# EAGLE design harp load cells v1.1 (EAGLE 6.5.0)
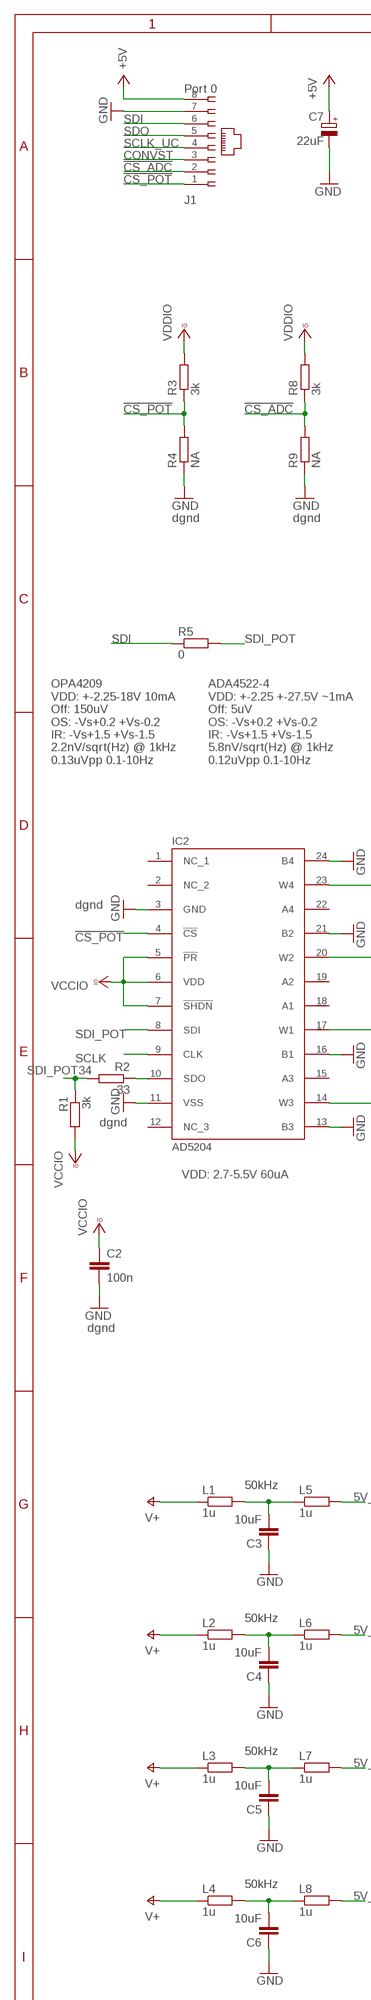
[diagram p0: schematic, sheet 1, part 1 of 2]
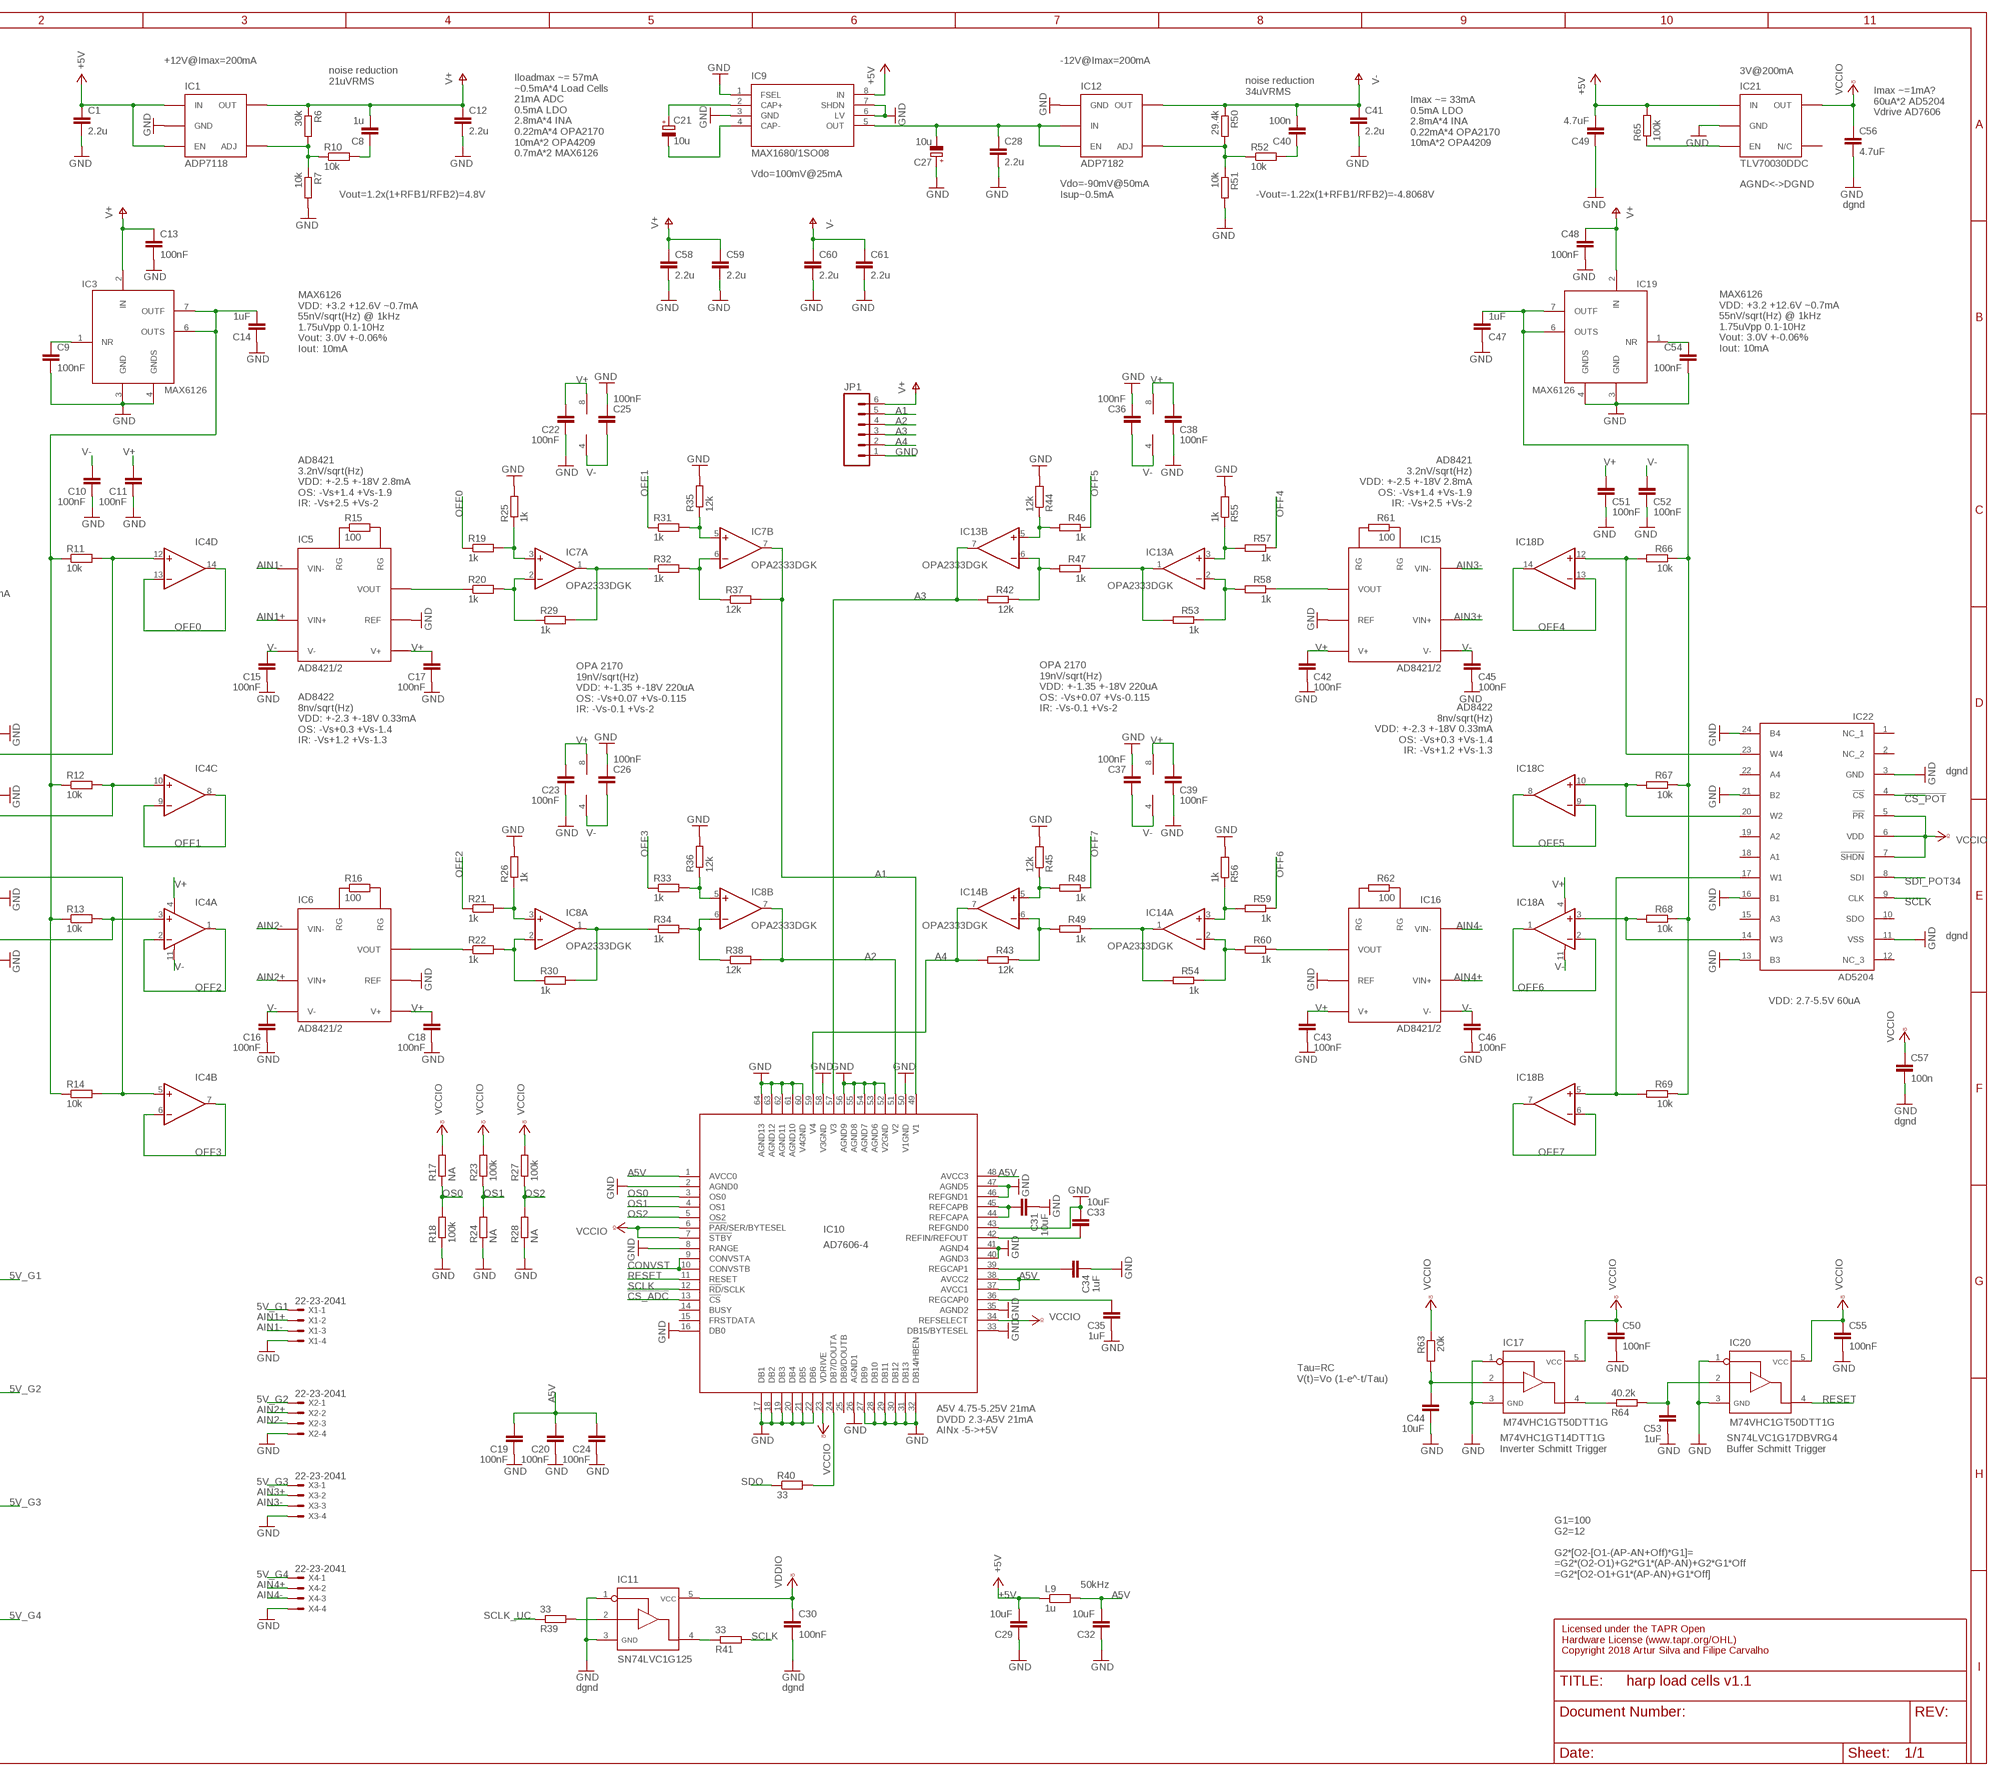
[diagram p1: schematic, sheet 1, part 2 of 2]

## Parts
C1  2.2u  C-EUC0603  [C0603]
C2  100n  C-EUC0402  [C0402]
C3  10uF  C-EUC0603  [C0603]
C4  10uF  C-EUC0603  [C0603]
C5  10uF  C-EUC0603  [C0603]
C6  10uF  C-EUC0603  [C0603]
C7  22uF  CAP_100UFHAND  [CAP_100UF_HAND]
C8  1u  C-EUC0402  [C0402]
C9  100nF  C-EUC0402  [C0402]
C10  100nF  C-EUC0402  [C0402]
C11  100nF  C-EUC0402  [C0402]
C12  2.2u  C-EUC0603  [C0603]
C13  100nF  C-EUC0402  [C0402]
C14  1uF  C-EUC0603  [C0603]
C15  100nF  C-EUC0402  [C0402]
C16  100nF  C-EUC0402  [C0402]
C17  100nF  C-EUC0402  [C0402]
C18  100nF  C-EUC0402  [C0402]
C19  100nF  C-EUC0402  [C0402]
C20  100nF  C-EUC0402  [C0402]
C21  10u  CPOL-EUA/3216-18W  [A/3216-18W]
C22  100nF  C-EUC0402  [C0402]
C23  100nF  C-EUC0402  [C0402]
C24  100nF  C-EUC0402  [C0402]
C25  100nF  C-EUC0402  [C0402]
C26  100nF  C-EUC0402  [C0402]
C27  10u  CPOL-EUA/3216-18W  [A/3216-18W]
C28  2.2u  C-EUC0603  [C0603]
C29  10uF  C-EUC0603  [C0603]
C30  100nF  C-EUC0402  [C0402]
C31  10uF  C-EUC0603  [C0603]
C32  10uF  C-EUC0603  [C0603]
C33  10uF  C-EUC0603  [C0603]
C34  1uF  C-EUC0402  [C0402]
C35  1uF  C-EUC0402  [C0402]
C36  100nF  C-EUC0402  [C0402]
C37  100nF  C-EUC0402  [C0402]
C38  100nF  C-EUC0402  [C0402]
C39  100nF  C-EUC0402  [C0402]
C40  100n  C-EUC0402  [C0402]
C41  2.2u  C-EUC0603  [C0603]
C42  100nF  C-EUC0402  [C0402]
C43  100nF  C-EUC0402  [C0402]
C44  10uF  C-EUC0603  [C0603]
C45  100nF  C-EUC0402  [C0402]
C46  100nF  C-EUC0402  [C0402]
C47  1uF  C-EUC0603  [C0603]
C48  100nF  C-EUC0402  [C0402]
C49  4.7uF  C-EUC0603  [C0603]
C50  100nF  C-EUC0402  [C0402]
C51  100nF  C-EUC0402  [C0402]
C52  100nF  C-EUC0402  [C0402]
C53  1uF  C-EUC0603  [C0603]
C54  100nF  C-EUC0402  [C0402]
C55  100nF  C-EUC0402  [C0402]
C56  4.7uF  C-EUC0603  [C0603]
C57  100n  C-EUC0402  [C0402]
C58  2.2u  C-EUC0603  [C0603]
C59  2.2u  C-EUC0603  [C0603]
C60  2.2u  C-EUC0603  [C0603]
C61  2.2u  C-EUC0603  [C0603]
IC1  ADP7118  [TSOT23-5]
IC2  AD5204  [TSSOP-24]
IC3  MAX6126  [SO08]
IC4  OPA4336T  [TSSOP-14]
IC5  AD8421/2  [MSOP8]
IC6  AD8421/2  [MSOP8]
IC7  OPA2333DGK  [MSOP08]
IC8  OPA2333DGK  [MSOP08]
IC9  MAX1680/1SO08  [SO08]
IC10  AD7606-4  [LQFP-64]
IC11  SN74LVC1G125  [SOT23-5]
IC12  ADP7182  [TSOT23-5]
IC13  OPA2333DGK  [MSOP08]
IC14  OPA2333DGK  [MSOP08]
IC15  AD8421/2  [MSOP8]
IC16  AD8421/2  [MSOP8]
IC17  M74VHC1GT50DTT1G  SN74LVC1G125  [SOT23-5]
IC18  OPA4336T  [TSSOP-14]
IC19  MAX6126  [SO08]
IC20  M74VHC1GT50DTT1G  SN74LVC1G125  [SOT23-5]
IC21  TLV70030DDC  TLV700XX  [TSOT23-5]
IC22  AD5204  [TSSOP-24]
J1  Port 0  520426-4  [520426-4]
JP1  M06NO_SILK  [1X06_NO_SILK]
L1  1u  R-EU_R0402  [R0402]
L2  1u  R-EU_R0402  [R0402]
L3  1u  R-EU_R0402  [R0402]
L4  1u  R-EU_R0402  [R0402]
L5  1u  R-EU_R0402  [R0402]
L6  1u  R-EU_R0402  [R0402]
L7  1u  R-EU_R0402  [R0402]
L8  1u  R-EU_R0402  [R0402]
L9  1u  R-EU_R0402  [R0402]
R1  3k  R-EU_R0402  [R0402]
R2  33  R-EU_R0402  [R0402]
R3  3k  R-EU_R0402  [R0402]
R4  NA  R-EU_R0402  [R0402]
R5  0  R-EU_R0402  [R0402]
R6  30k  R-EU_R0402  [R0402]
R7  10k  R-EU_R0402  [R0402]
R8  3k  R-EU_R0402  [R0402]
R9  NA  R-EU_R0402  [R0402]
R10  10k  R-EU_R0402  [R0402]
R11  10k  R-EU_R0402  [R0402]
R12  10k  R-EU_R0402  [R0402]
R13  10k  R-EU_R0402  [R0402]
R14  10k  R-EU_R0402  [R0402]
R15  100  R-EU_R0402  [R0402]
R16  100  R-EU_R0402  [R0402]
R17  NA  R-EU_R0402  [R0402]
R18  100k  R-EU_R0402  [R0402]
R19  1k  R-EU_R0402  [R0402]
R20  1k  R-EU_R0402  [R0402]
R21  1k  R-EU_R0402  [R0402]
R22  1k  R-EU_R0402  [R0402]
R23  100k  R-EU_R0402  [R0402]
R24  NA  R-EU_R0402  [R0402]
R25  1k  R-EU_R0402  [R0402]
R26  1k  R-EU_R0402  [R0402]
R27  100k  R-EU_R0402  [R0402]
R28  NA  R-EU_R0402  [R0402]
R29  1k  R-EU_R0402  [R0402]
R30  1k  R-EU_R0402  [R0402]
R31  1k  R-EU_R0402  [R0402]
R32  1k  R-EU_R0402  [R0402]
R33  1k  R-EU_R0402  [R0402]
R34  1k  R-EU_R0402  [R0402]
R35  12k  R-EU_R0402  [R0402]
R36  12k  R-EU_R0402  [R0402]
R37  12k  R-EU_R0402  [R0402]
R38  12k  R-EU_R0402  [R0402]
R39  33  R-EU_R0402  [R0402]
R40  33  R-EU_R0402  [R0402]
R41  33  R-EU_R0402  [R0402]
R42  12k  R-EU_R0402  [R0402]
R43  12k  R-EU_R0402  [R0402]
R44  12k  R-EU_R0402  [R0402]
R45  12k  R-EU_R0402  [R0402]
R46  1k  R-EU_R0402  [R0402]
R47  1k  R-EU_R0402  [R0402]
R48  1k  R-EU_R0402  [R0402]
R49  1k  R-EU_R0402  [R0402]
R50  29.4k  R-EU_R0402  [R0402]
R51  10k  R-EU_R0402  [R0402]
R52  10k  R-EU_R0402  [R0402]
R53  1k  R-EU_R0402  [R0402]
R54  1k  R-EU_R0402  [R0402]
R55  1k  R-EU_R0402  [R0402]
R56  1k  R-EU_R0402  [R0402]
R57  1k  R-EU_R0402  [R0402]
R58  1k  R-EU_R0402  [R0402]
R59  1k  R-EU_R0402  [R0402]
R60  1k  R-EU_R0402  [R0402]
R61  100  R-EU_R0402  [R0402]
R62  100  R-EU_R0402  [R0402]
R63  20k  R-EU_R0402  [R0402]
R64  40.2k  R-EU_R0402  [R0402]
R65  100k  R-EU_R0402  [R0402]
R66  10k  R-EU_R0402  [R0402]
R67  10k  R-EU_R0402  [R0402]
R68  10k  R-EU_R0402  [R0402]
R69  10k  R-EU_R0402  [R0402]
X1  22-23-2041  [22-23-2041]
X2  22-23-2041  [22-23-2041]
X3  22-23-2041  [22-23-2041]
X4  22-23-2041  [22-23-2041]

## Nets
5V_G1: L5.2 X1.1
5V_G2: L6.2 X2.1
5V_G3: L7.2 X3.1
5V_G4: L8.2 X4.1
!CS_ADC: IC10.13(!CS) J1.2 R8.1 R9.2
!CS_POT: IC2.4(!CS) IC22.4(!CS) J1.1 R3.1 R4.2
+5V: C1.1 C7.+ C29.2 C49.2 IC1.1(IN) IC1.3(EN) IC9.8(IN) IC21.1(IN) J1.8 L9.1 R65.2
A1: IC7.7(B:OUT) IC10.49(V1) JP1.5 R37.2
A2: IC8.7(B:OUT) IC10.51(V2) JP1.4 R38.2
A3: IC10.57(V3) IC13.7(B:OUT) JP1.3 R42.2
A4: IC10.59(V4) IC14.7(B:OUT) JP1.2 R43.2
A5V: C19.2 C20.2 C24.2 C32.2 IC10.1(AVCC0) IC10.37(AVCC1) IC10.38(AVCC2) IC10.48(AVCC3) L9.2
AIN1+: IC5.P$4(VIN+) X1.2
AIN1-: IC5.P$1(VIN-) X1.3
AIN2+: IC6.P$4(VIN+) X2.2
AIN2-: IC6.P$1(VIN-) X2.3
AIN3+: IC15.P$4(VIN+) X3.2
AIN3-: IC15.P$1(VIN-) X3.3
AIN4+: IC16.P$4(VIN+) X4.2
AIN4-: IC16.P$1(VIN-) X4.3
CONVST: IC10.9(CONVSTA) IC10.10(CONVSTB) J1.3
GND: C1.2 C2.2 C3.1 C4.1 C5.1 C6.1 C7.- C9.2 C10.1 C11.1 C12.2 C13.2 C14.1 C15.1 C16.1 C17.1 C18.1 C19.1 C20.1 C22.1 C23.1 C24.1 C25.1 C26.1 C27.+ C28.2 C29.1 C30.2 C31.1 C32.1 C33.1 C34.1 C35.1 C36.1 C37.1 C38.1 C39.1 C41.2 C42.1 C43.1 C44.1 C45.1 C46.1 C47.1 C48.2 C49.1 C50.2 C51.1 C52.1 C53.1 C54.2 C55.2 C56.2 C57.2 C58.2 C59.2 C60.2 C61.2 IC1.2(GND) IC2.3(GND) IC2.11(VSS) IC2.13(B3) IC2.16(B1) IC2.21(B2) IC2.24(B4) IC3.3(GND) IC3.4(GNDS) IC5.P$6(REF) IC6.P$6(REF) IC9.1(FSEL) IC9.3(GND) IC9.6(LV) IC9.7(SHDN) IC10.2(AGND0) IC10.8(RANGE) IC10.16(DB0) IC10.17(DB1) IC10.18(DB2) IC10.19(DB3) IC10.20(DB4) IC10.21(DB5) IC10.22(DB6) IC10.26(AGND1) IC10.27(DB9) IC10.28(DB10) IC10.29(DB11) IC10.30(DB12) IC10.31(DB13) IC10.32(DB14/HBEN) IC10.33(DB15/BYTESEL) IC10.35(AGND2) IC10.40(AGND3) IC10.41(AGND4) IC10.43(REFGND0) IC10.46(REFGND1) IC10.47(AGND5) IC10.50(V1GND) IC10.52(V2GND) IC10.53(AGND6) IC10.54(AGND7) IC10.55(AGND8) IC10.56(AGND9) IC10.58(V3GND) IC10.60(V4GND) IC10.61(AGND10) IC10.62(AGND11) IC10.63(AGND12) IC10.64(AGND13) IC11.1 IC11.3 IC12.1(GND) IC15.P$6(REF) IC16.P$6(REF) IC17.1 IC17.3 IC19.3(GND) IC19.4(GNDS) IC20.1 IC20.3 IC21.2(GND) IC22.3(GND) IC22.11(VSS) IC22.13(B3) IC22.16(B1) IC22.21(B2) IC22.24(B4) J1.7 JP1.1 R4.1 R7.2 R9.1 R18.1 R24.1 R25.2 R26.2 R28.1 R35.2 R36.2 R44.2 R45.2 R51.2 R55.2 R56.2 X1.4 X2.4 X3.4 X4.4
N$2: IC21.3(EN) R65.1
N$3: IC12.4(ADJ) R50.2 R51.1 R52.1
N$4: C44.2 IC17.2 R63.2
N$5: C35.2 IC10.36(REGCAP0)
N$6: IC6.P$7(VOUT) R22.1
N$7: C40.1 R52.2
N$8: C6.2 L4.2 L8.1
N$9: IC17.4 R64.1
N$10: C21.+ IC9.2(CAP+)
N$11: C21.- IC9.4(CAP-)
N$12: C27.- C28.1 IC9.5(OUT) IC12.2(IN) IC12.3(EN)
N$13: C53.2 IC20.2 R64.2
N$14: IC7.6(B:-IN) R32.2 R37.1
N$15: C34.2 IC10.39(REGCAP1)
N$16: IC13.2(A:-IN) R53.1 R58.2
N$17: IC7.2(A:-IN) R20.2 R29.1
N$18: IC7.3(A:+IN) R19.2 R25.1
N$19: IC7.5(B:+IN) R31.2 R35.1
N$20: C33.2 IC10.42(REFIN/REFOUT)
N$21: IC13.3(A:+IN) R55.1 R57.2
N$22: IC13.6(B:-IN) R42.1 R47.2
N$23: IC13.5(B:+IN) R44.1 R46.2
N$24: C31.2 IC10.44(REFCAPA) IC10.45(REFCAPB)
N$25: C8.1 R10.2
N$26: IC1.4(ADJ) R6.2 R7.1 R10.1
N$27: IC5.P$2(RG) R15.2
N$28: IC5.P$3(RG) R15.1
N$29: IC5.P$7(VOUT) R20.1
N$30: IC8.2(A:-IN) R22.2 R30.1
N$31: IC6.P$2(RG) R16.2
N$32: IC6.P$3(RG) R16.1
N$33: IC8.3(A:+IN) R21.2 R26.1
N$34: IC7.1(A:OUT) R29.2 R32.1
N$35: IC8.6(B:-IN) R34.2 R38.1
N$36: C9.1 IC3.1(NR)
N$37: IC8.5(B:+IN) R33.2 R36.1
N$38: IC15.P$2(RG) R61.2
N$39: IC8.1(A:OUT) R30.2 R34.1
N$40: IC15.P$3(RG) R61.1
N$41: IC15.P$7(VOUT) R58.1
N$42: IC2.20(W2) IC4.10(C:+IN) R12.2
N$43: IC16.P$2(RG) R62.2
N$44: IC2.17(W1) IC4.5(B:+IN) R14.2
N$45: IC16.P$3(RG) R62.1
N$46: C14.2 IC3.6(OUTS) IC3.7(OUTF) R11.1 R12.1 R13.1 R14.1
N$47: IC18.10(C:+IN) IC22.20(W2) R67.2
N$48: IC18.12(D:+IN) IC22.23(W4) R66.2
N$49: IC11.2 R39.2
N$50: IC2.10(SDO) R2.1
N$51: C5.2 L3.2 L7.1
N$52: IC18.3(A:+IN) IC22.14(W3) R68.2
N$53: IC18.5(B:+IN) IC22.17(W1) R69.2
N$54: IC13.1(A:OUT) R47.1 R53.2
N$55: C54.1 IC19.1(NR)
N$56: C47.2 IC19.6(OUTS) IC19.7(OUTF) R66.1 R67.1 R68.1 R69.1
N$57: IC2.14(W3) IC4.3(A:+IN) R13.2
N$58: IC14.2(A:-IN) R54.1 R60.2
N$59: IC14.3(A:+IN) R56.1 R59.2
N$60: IC14.6(B:-IN) R43.1 R49.2
N$61: IC14.5(B:+IN) R45.1 R48.2
N$62: IC2.23(W4) IC4.12(D:+IN) R11.2
N$63: IC11.4 R41.1
N$64: IC14.1(A:OUT) R49.1 R54.2
N$65: IC16.P$7(VOUT) R60.1
N$72: C4.2 L2.2 L6.1
N$73: C3.2 L1.2 L5.1
N$78: IC10.24(DB7/DOUTA) R40.2
OFF0: IC4.13(D:-IN) IC4.14(D:OUT) R19.1
OFF1: IC4.8(C:OUT) IC4.9(C:-IN) R31.1
OFF2: IC4.1(A:OUT) IC4.2(A:-IN) R21.1
OFF3: IC4.6(B:-IN) IC4.7(B:OUT) R33.1
OFF4: IC18.13(D:-IN) IC18.14(D:OUT) R57.1
OFF5: IC18.8(C:OUT) IC18.9(C:-IN) R46.1
OFF6: IC18.1(A:OUT) IC18.2(A:-IN) R59.1
OFF7: IC18.6(B:-IN) IC18.7(B:OUT) R48.1
OS0: IC10.3(OS0) R17.1 R18.2
OS1: IC10.4(OS1) R23.1 R24.2
OS2: IC10.5(OS2) R27.1 R28.2
RESET: IC10.11(RESET) IC20.4
SCLK: IC2.9(CLK) IC10.12(!RD!/SCLK) IC22.9(CLK) R41.2
SCLK_UC: J1.4 R39.1
SDI: J1.6 R5.1
SDI_POT: IC2.8(SDI) R5.2
SDI_POT34: IC22.8(SDI) R1.1 R2.2
SDO: J1.5 R40.1
V+: C8.2 C11.2 C12.1 C13.1 C17.2 C18.2 C22.2 C23.2 C38.2 C39.2 C42.2 C43.2 C48.1 C51.2 C58.1 C59.1 IC1.5(OUT) IC3.2(IN) IC4.4(A:V+) IC5.P$8(V+) IC6.P$8(V+) IC7.8(P:V+) IC8.8(P:V+) IC13.8(P:V+) IC14.8(P:V+) IC15.P$8(V+) IC16.P$8(V+) IC18.4(A:V+) IC19.2(IN) JP1.6 L1.1 L2.1 L3.1 L4.1 R6.1
V-: C10.2 C15.2 C16.2 C25.2 C26.2 C36.2 C37.2 C40.2 C41.1 C45.2 C46.2 C52.2 C60.1 C61.1 IC4.11(A:V-) IC5.P$5(V-) IC6.P$5(V-) IC7.4(P:V-) IC8.4(P:V-) IC12.5(OUT) IC13.4(P:V-) IC14.4(P:V-) IC15.P$5(V-) IC16.P$5(V-) IC18.11(A:V-) R50.1
VCCIO: C2.1 C30.1 C50.1 C55.1 C56.1 C57.1 IC2.5(!PR) IC2.6(VDD) IC2.7(!SHDN) IC10.6(!PAR!/SER/BYTESEL) IC10.7(!STBY) IC10.23(VDRIVE) IC10.34(REFSELECT) IC11.5 IC17.5 IC20.5 IC21.5(OUT) IC22.5(!PR) IC22.6(VDD) IC22.7(!SHDN) R1.2 R3.2 R8.2 R17.2 R23.2 R27.2 R63.1 ; supply symbol labelled VDDIO
Unconnected: IC2.1(NC_1) IC2.2(NC_2) IC2.12(NC_3) IC2.15(A3) IC2.18(A1) IC2.19(A2) IC2.22(A4) IC10.14(BUSY) IC10.15(FRSTDATA) IC10.25(DB8/DOUTB) IC21.4(N/C) IC22.1(NC_1) IC22.2(NC_2) IC22.10(SDO) IC22.12(NC_3) IC22.15(A3) IC22.18(A1) IC22.19(A2) IC22.22(A4)

## Notes on the sheet
- +12V@Imax=200mA | -12V@Imax=200mA
- 3V@200mA
- noise reduction 
  21uVRMS
- noise reduction 
  34uVRMS
- Imax ~=1mA?
  60uA*2 AD5204
  Vdrive AD7606
- Imax ~= 33mA 
  0.5mA LDO
  2.8mA*4 INA
  0.22mA*4 OPA2170
  10mA*2 OPA4209
- Iloadmax ~= 57mA
  ~0.5mA*4 Load Cells
  21mA ADC
  0.5mA LDO
  2.8mA*4 INA
  0.22mA*4 OPA2170
  10mA*2 OPA4209
  0.7mA*2 MAX6126
- Vdo=100mV@25mA
- AGND<->DGND
- Vout=1.2x(1+RFB1/RFB2)=4.8V
- Vdo=-90mV@50mA
  Isup~0.5mA
- -Vout=-1.22x(1+RFB1/RFB2)=-4.8068V
- dgnd
- MAX6126
  VDD: +3.2 +12.6V ~0.7mA
  55nV/sqrt(Hz) @ 1kHz
  1.75uVpp 0.1-10Hz
  Vout: 3.0V +-0.06%
  Iout: 10mA
- MAX6126
  VDD: +3.2 +12.6V ~0.7mA
  55nV/sqrt(Hz) @ 1kHz
  1.75uVpp 0.1-10Hz
  Vout: 3.0V +-0.06%
  Iout: 10mA
- dgnd | dgnd
- AD8421
  3.2nV/sqrt(Hz)
  VDD: +-2.5 +-18V 2.8mA
  OS: -Vs+1.4 +Vs-1.9
  IR: -Vs+2.5 +Vs-2
- AD8421
  3.2nV/sqrt(Hz)
  VDD: +-2.5 +-18V 2.8mA
  OS: -Vs+1.4 +Vs-1.9
  IR: -Vs+2.5 +Vs-2
- OPA4209
  VDD: +-2.25-18V 10mA
  Off: 150uV
  OS: -Vs+0.2 +Vs-0.2 
  IR: -Vs+1.5 +Vs-1.5
  2.2nV/sqrt(Hz) @ 1kHz
  0.13uVpp 0.1-10Hz
- ADA4522-4
  VDD: +-2.25 +-27.5V ~1mA
  Off: 5uV
  OS: -Vs+0.2 +Vs-0.2 
  IR: -Vs+1.5 +Vs-1.5
  5.8nV/sqrt(Hz) @ 1kHz
  0.12uVpp 0.1-10Hz
- OPA 2170
  19nV/sqrt(Hz)
  VDD: +-1.35 +-18V 220uA
  OS: -Vs+0.07 +Vs-0.115
  IR: -Vs-0.1 +Vs-2
- OPA 2170
  19nV/sqrt(Hz)
  VDD: +-1.35 +-18V 220uA
  OS: -Vs+0.07 +Vs-0.115
  IR: -Vs-0.1 +Vs-2
- AD8422
  8nv/sqrt(Hz)
  VDD: +-2.3 +-18V 0.33mA
  OS: -Vs+0.3 +Vs-1.4
  IR: -Vs+1.2 +Vs-1.3
- AD8422
  8nv/sqrt(Hz)
  VDD: +-2.3 +-18V 0.33mA
  OS: -Vs+0.3 +Vs-1.4
  IR: -Vs+1.2 +Vs-1.3
- dgnd | dgnd
- dgnd
- dgnd
- VDD: 2.7-5.5V 60uA | VDD: 2.7-5.5V 60uA
- dgnd
- dgnd
- 50kHz
- 50kHz
- Tau=RC
  V(t)=Vo (1-e^-t/Tau)
- A5V 4.75-5.25V 21mA
  DVDD 2.3-A5V 21mA
  AINx -5->+5V
- M74VHC1GT14DTT1G
  Inverter Schmitt Trigger
- SN74LVC1G17DBVRG4
  Buffer Schmitt Trigger
- 50kHz
- G1=100
  G2=12
  
  G2*[O2-[O1-(AP-AN+Off)*G1]=
  =G2*(O2-O1)+G2*G1*(AP-AN)+G2*G1*Off
  =G2*[O2-O1+G1*(AP-AN)+G1*Off]
- 50kHz
- 50kHz
- Licensed under the TAPR Open
  Hardware License (www.tapr.org/OHL)
  Copyright 2018 Artur Silva and Filipe Carvalho
- dgnd | dgnd

## Library data of the parts
C1-C6 C8-C20 C22-C26 C28-C61 = rcl:C-EU: CAPACITOR, European symbol
C7 = CNP-miscellaneous:CAP_100UF
C21 C27 = rcl:CPOL-EU: POLARIZED CAPACITOR, European symbol
IC1 = CNP-ics 2:ADP7118
IC2 IC22 = CNP-ics 1:AD5204
IC3 IC19 = CNP-ics 1:MAX6126
IC4 IC18 = CNP-ics 1:OPA4336: Single-Supply, MicroPower CMOS Operational Amplifiers MicroAmplifier (TM) Series
IC5 IC6 IC15 IC16 = CNP-ics 2:AD8421/2
IC7 IC8 IC13 IC14 = linear:OPA2333: DUAL 1.8V, microPOWER CMOS OPERATIONAL AMPLIFIERS Zerø-Drift Series Source: Texas Instruments (Burr-Brown) .. U11 opa333 Operational Amp.pdf
IC9 = CNP-ics 2:MAX1680/1
IC10 = CNP-ics 1:AD7606-4
IC11 IC17 IC20 = My_library 0v2:SN74LVC1G125
IC12 = CNP-ics 2:ADP7182
IC21 = CNP-ics 2:TLV700XX
J1 = con-amp:520426-4: AMP connector
JP1 = SparkFun-Connectors:M06: Header 6 Standard 6-pin 0.1" header. Use with straight break away headers (SKU : PRT-00116), right angle break away headers (PRT-00553), swiss pins (PRT-00743), machine pins (PRT-00117), and female headers (PRT-00115). Molex polarized connector foot print use with SKU : PRT-08094 with associated crimp pins and housings. NOTES ON THE VARIANTS LOCK and LOCK_LONGPADS... This footprint was designed to help hold the alignment of a through-hole component (i.e. 6-pin header) while soldering it into place. You may notice that each hole has been shifted either up or down by 0.005 of an inch from it's more standard position (which is a perfectly straight line). This slight alteration caused the pins (the squares in the middle) to touch the edges of the holes. Because they are alternating, it causes a "brace" to hold the component in place. 0.005 has proven to be the perfect amount of "off-center" position when using our standard breakaway headers. Although looks a little odd when you look at the bare footprint, once you have a header in there, the alteration is very hard to notice. Also,if you push a header all the way into place, it is covered up entirely on the bottom side. This idea of altering the position of holes to aid alignment will be further integrated into the Sparkfun Library for other footprints. It can help hold any component with 3 or more connection pins.
L1-L9 R1-R69 = rcl:R-EU_: RESISTOR, European symbol
X1-X4 = con-molex:22-23-2041: .100" (2.54mm) Center Header - 4 Pin; MF: MOLEX; MPN: 22-23-2041; OC_FARNELL: 1462920; OC_NEWARK: 38C0355

## Board
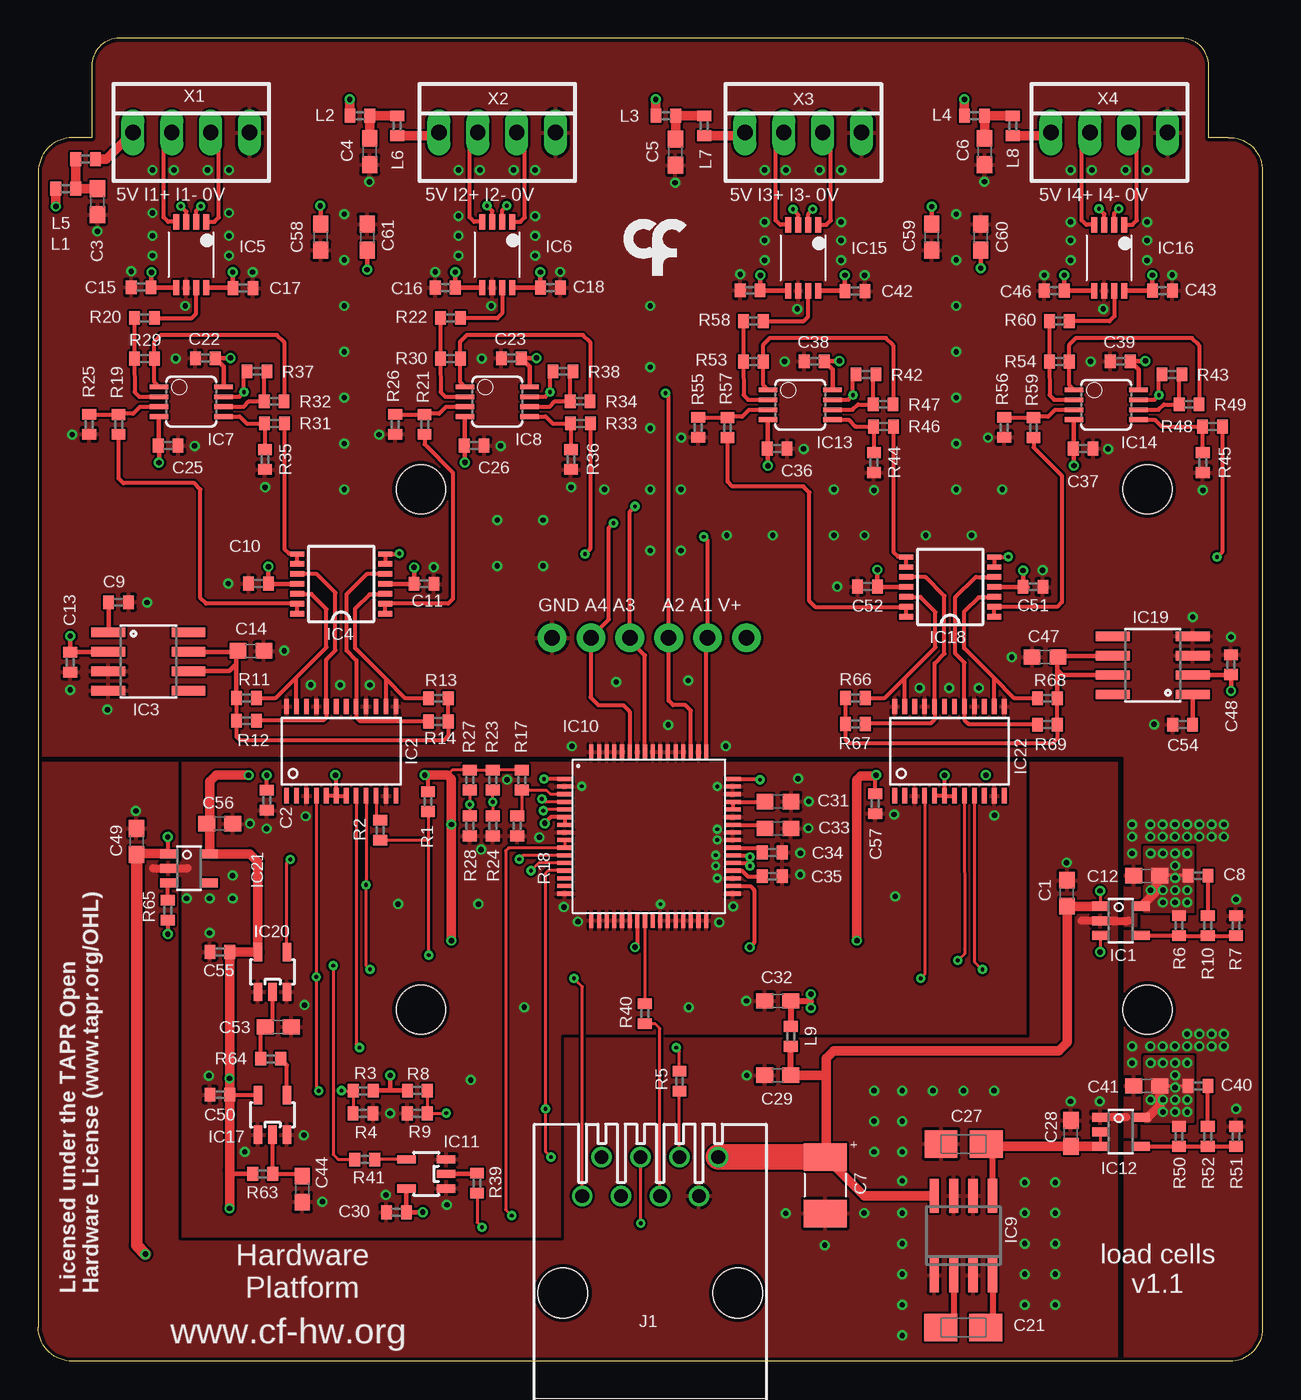
[diagram p2: board, top side]
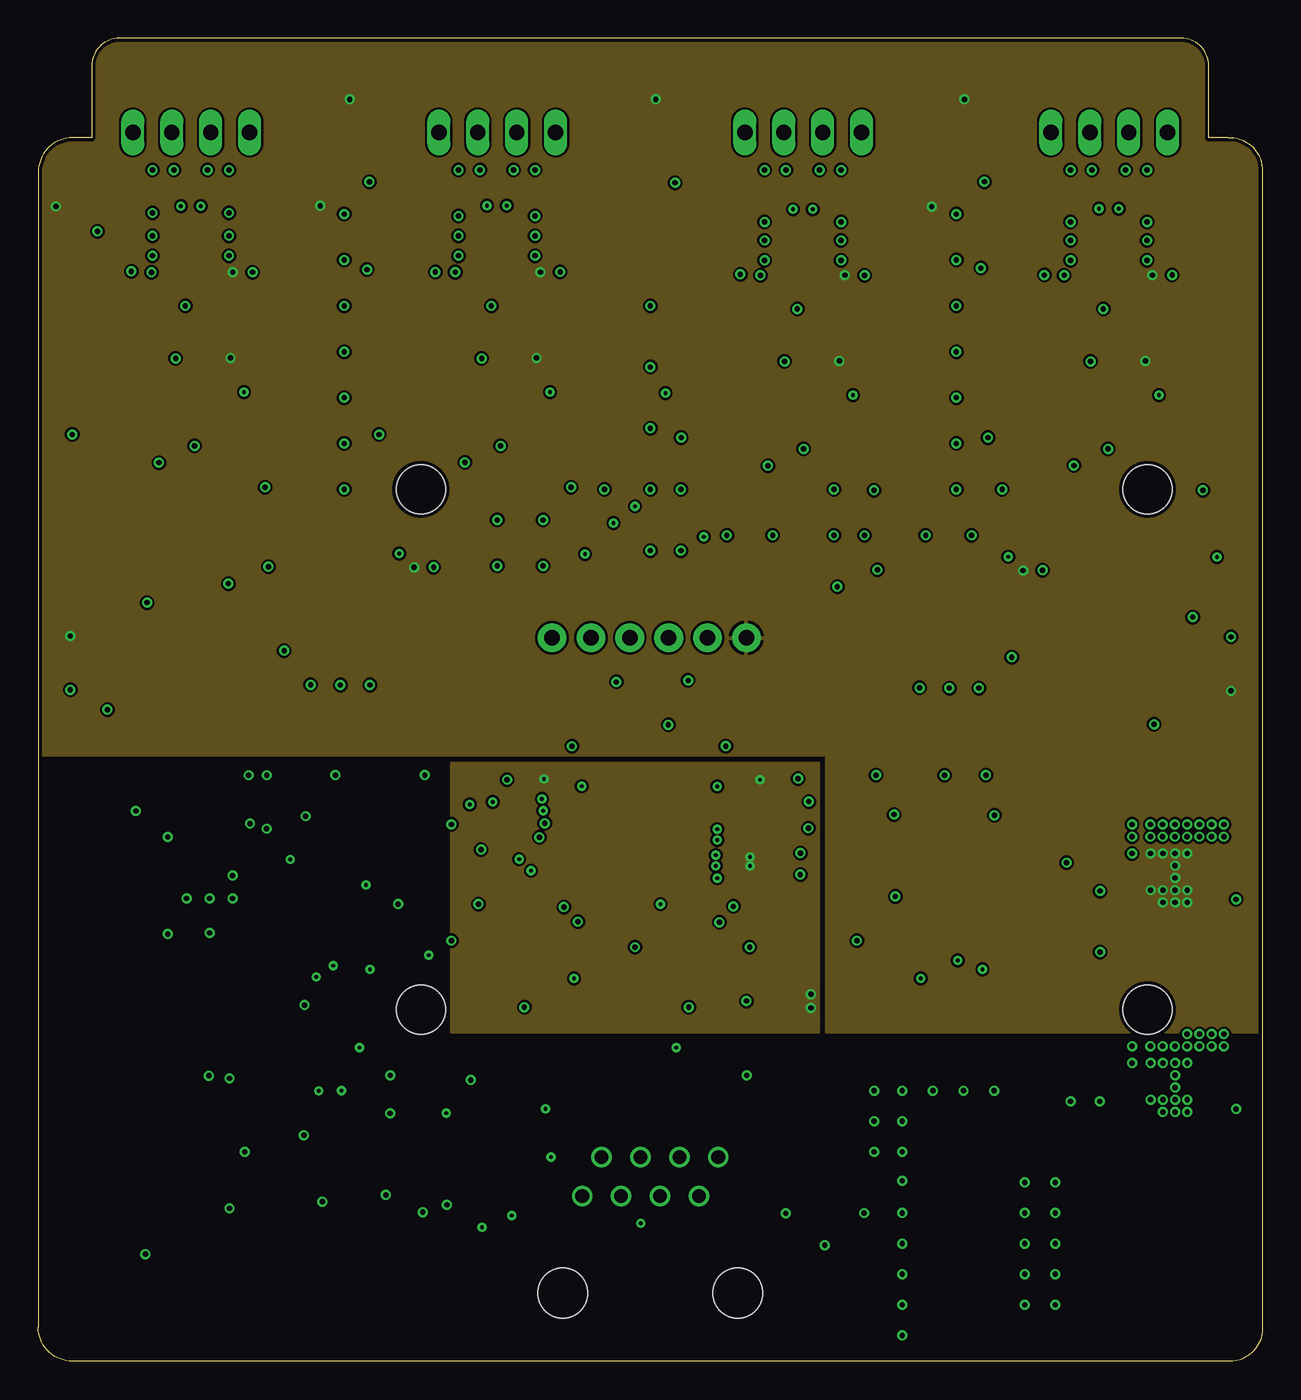
[diagram p3: board, inner layer Route2]
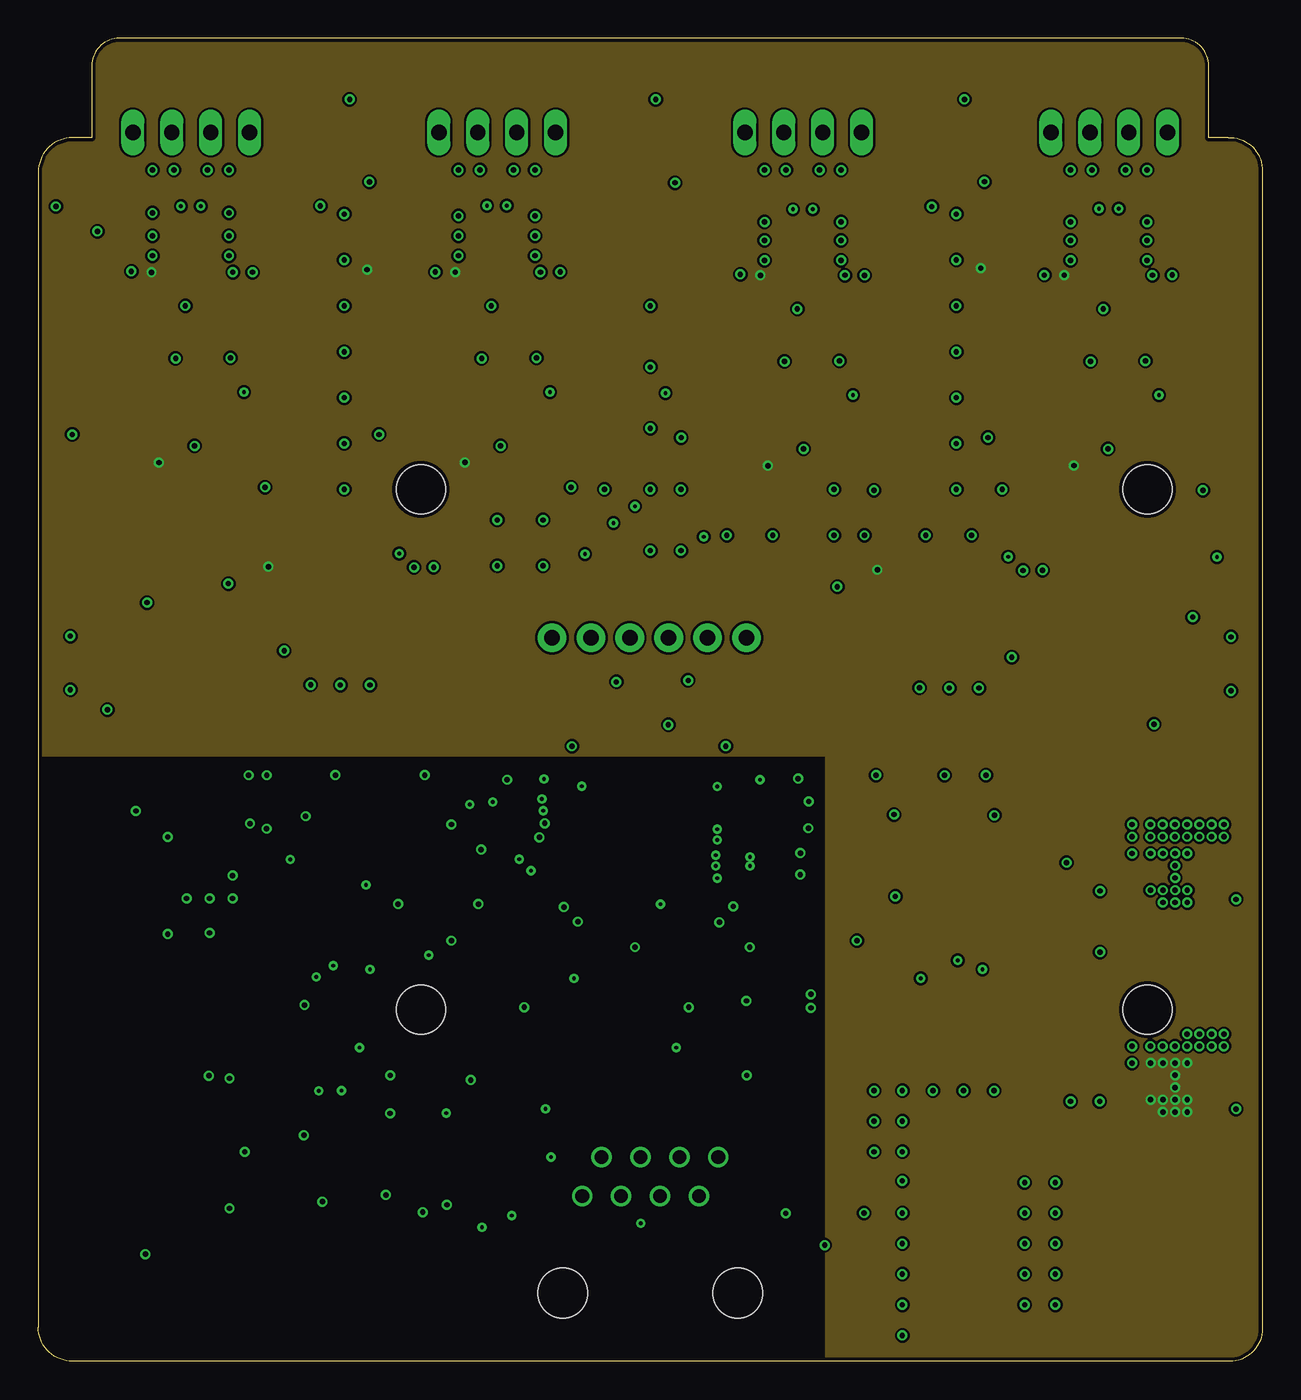
[diagram p4: board, inner layer Route3]
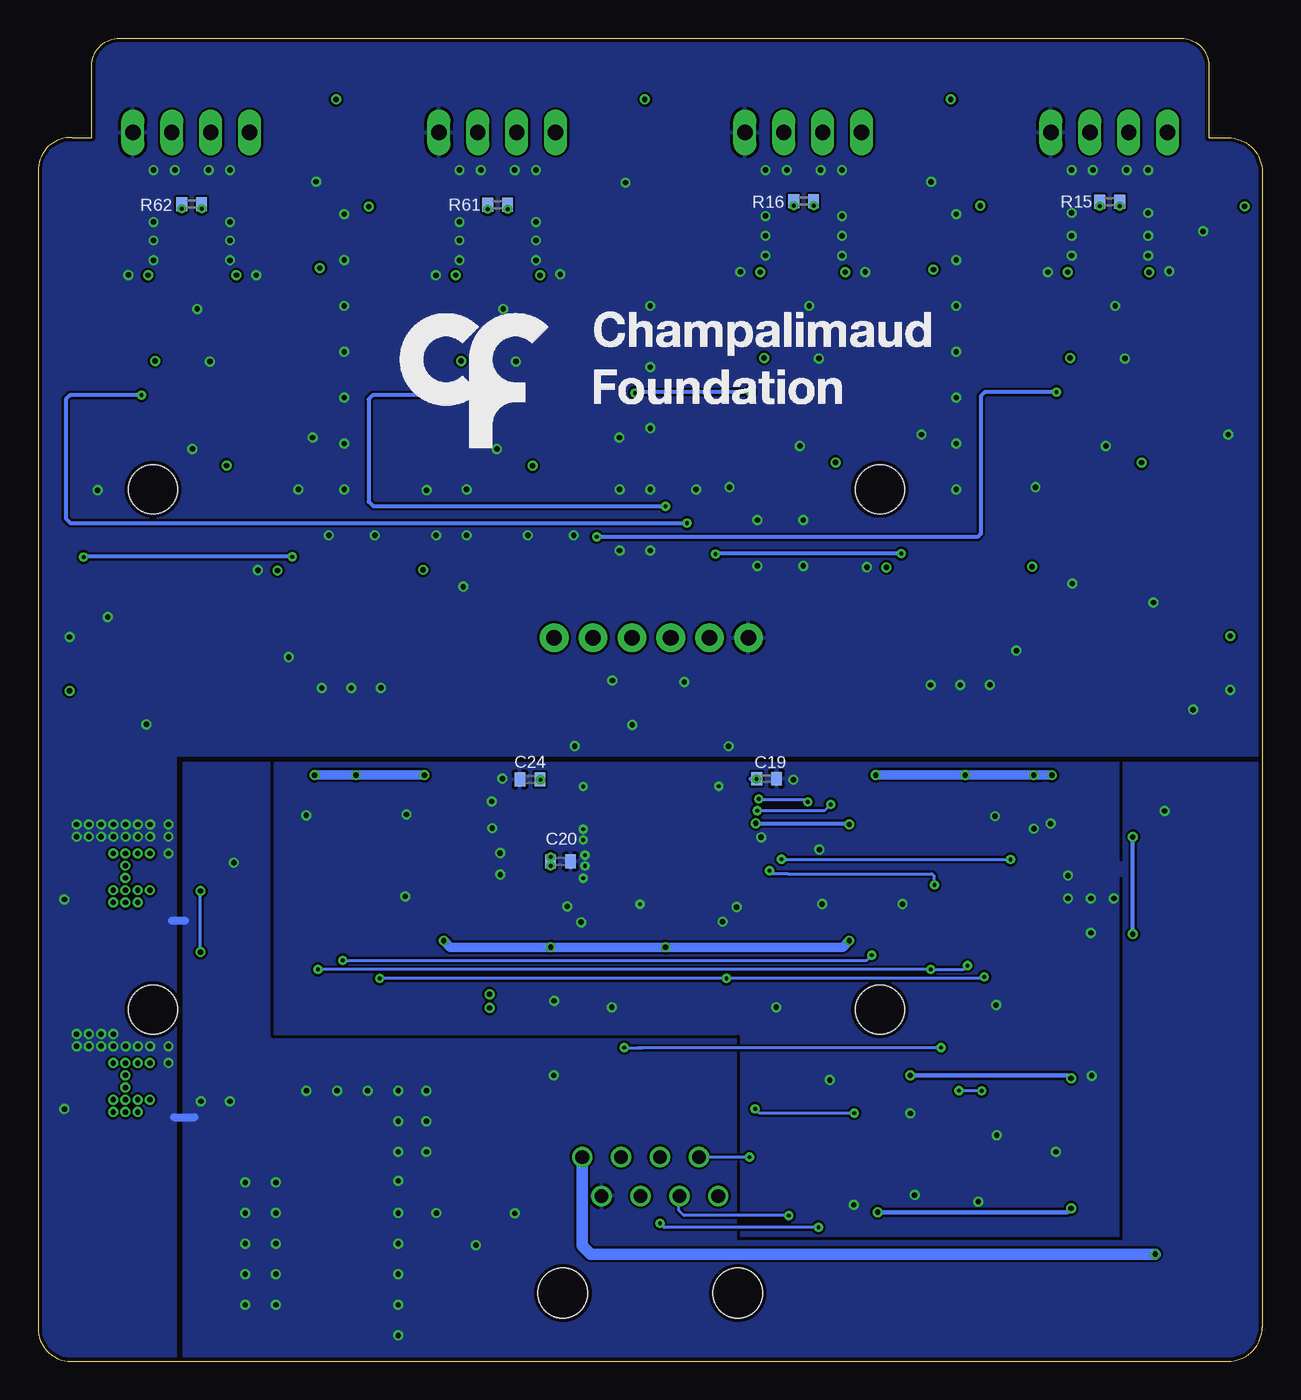
[diagram p5: board, bottom side, seen from below]

Size 80 x 86.5 mm. Coordinates in mm from the lower left corner, seen from the top.
Outline: 0,77.76 0,2.24 arc90 2.24,0 77.89,0 arc90 80,2.11 80,78 arc90 77.76,80 76.5,80 76.5,84.7 arc90 74.7,86.5 5.3,86.5 arc90 3.5,84.7 3.5,80 2.24,80 arc90 0,77.76
Copper layers (1+2*3+16): Top 0.018mm / dielectric 0.36mm / Route2 0.035mm / dielectric 0.71mm / Route3 0.035mm / dielectric 0.36mm / Bottom 0.018mm
Design rules "eC_4Layer_PClass6_BaseCopperO18-I35_eCDefault *": minimum track width 0.15mm, minimum drill 0.15mm, track to track 0.15mm, track to pad 0.15mm, pad to pad 0.15mm, via to via 0.15mm, smd to smd 0mil, copper to edge 0.25mm, drill to drill 0.35mm, minimum pad ring 0.175mm, minimum via ring 0.125mm, stop-mask expansion 0mil, vias tented up to drill 0.45mm, thermal gap 0.2mm
Holes 3.2 mm at 25,57 25,23 72.5,57 72.5,23
tRestrict: 12 lines
bRestrict: 10 lines

### Footprints (pad centres in the part's own frame; a part is rotated, then mirrored left to right if it is on the bottom)
C0603 = smd 1.1 x 1: 1 -0.85,0; 2 0.85,0
C0402 = smd 0.7 x 0.9: 1 -0.65,0; 2 0.65,0
CAP_100UF_HAND = smd 1.8 x 2.8: + -1.85,0; - 1.85,0
A/3216-18W = smd 2.15 x 1.8: + 1.475,0; - -1.475,0
TSOT23-5 = smd 0.6 x 1.05: 1 -0.95,-1.354; 2 0,-1.354; 3 0.95,-1.354; 4 0.95,1.354; 5 -0.95,1.354
TSSOP-24 = smd 0.305 x 0.991: 1 -3.575,-2.918; 2 -2.925,-2.918; 3 -2.275,-2.918; 4 -1.625,-2.918; 5 -0.975,-2.918; 6 -0.325,-2.918; 7 0.325,-2.918; 8 0.975,-2.918; 9 1.625,-2.918; 10 2.275,-2.918; 11 2.925,-2.918; 12 3.575,-2.918; 13 3.575,2.918; 14 2.925,2.918; 15 2.275,2.918; 16 1.625,2.918; 17 0.975,2.918; 18 0.325,2.918; 19 -0.325,2.918; 20 -0.975,2.918; 21 -1.625,2.918; 22 -2.275,2.918; 23 -2.925,2.918; 24 -3.575,2.918
SO08 = smd 0.61 x 2.21: 1 -1.905,-2.616; 2 -0.635,-2.616; 3 0.635,-2.616; 4 1.905,-2.616; 5 1.905,2.616; 6 0.635,2.616; 7 -0.635,2.616; 8 -1.905,2.616
TSSOP-14 = smd 0.9 x 0.35: 1 -2.875,1.95; 2 -2.875,1.3; 3 -2.875,0.65; 4 -2.875,0; 5 -2.875,-0.65; 6 -2.875,-1.3; 7 -2.875,-1.95; 8 2.875,-1.95; 9 2.875,-1.3; 10 2.875,-0.65; 11 2.875,0; 12 2.875,0.65; 13 2.875,1.3; 14 2.875,1.95
MSOP8 = smd 0.4 x 1.01: P$1 -0.975,-2.155; P$2 -0.325,-2.155; P$3 0.325,-2.155; P$4 0.975,-2.155; P$5 0.975,2.155; P$6 0.325,2.155; P$7 -0.325,2.155; P$8 -0.975,2.155
MSOP08 = smd 0.3 x 1.2: 1 -0.976,-2.113; 2 -0.326,-2.113; 3 0.324,-2.113; 4 0.974,-2.113; 5 0.974,2.112; 6 0.324,2.112; 7 -0.326,2.112; 8 -0.976,2.112
SO08' = smd 0.6 x 2.2: 1 -1.905,-2.6; 2 -0.635,-2.6; 3 0.635,-2.6; 4 1.905,-2.6; 5 1.905,2.6; 6 0.635,2.6; 7 -0.635,2.6; 8 -1.905,2.6
LQFP-64 = smd 0.27 x 1: 1 -3.75,-5.5; 2 -3.25,-5.5; 3 -2.75,-5.5; 4 -2.25,-5.5; 5 -1.75,-5.5; 6 -1.25,-5.5; 7 -0.75,-5.5; 8 -0.25,-5.5; 9 0.25,-5.5; 10 0.75,-5.5; 11 1.25,-5.5; 12 1.75,-5.5; 13 2.25,-5.5; 14 2.75,-5.5; 15 3.25,-5.5; 16 3.75,-5.5; 33 3.75,5.5; 34 3.25,5.5; 35 2.75,5.5; 36 2.25,5.5; 37 1.75,5.5; 38 1.25,5.5; 39 0.75,5.5; 40 0.25,5.5; 41 -0.25,5.5; 42 -0.75,5.5; 43 -1.25,5.5; 44 -1.75,5.5; 45 -2.25,5.5; 46 -2.75,5.5; 47 -3.25,5.5; 48 -3.75,5.5 | smd 1 x 0.27: 17 5.5,-3.75; 18 5.5,-3.25; 19 5.5,-2.75; 20 5.5,-2.25; 21 5.5,-1.75; 22 5.5,-1.25; 23 5.5,-0.75; 24 5.5,-0.25; 25 5.5,0.25; 26 5.5,0.75; 27 5.5,1.25; 28 5.5,1.75; 29 5.5,2.25; 30 5.5,2.75; 31 5.5,3.25; 32 5.5,3.75; 49 -5.5,3.75; 50 -5.5,3.25; 51 -5.5,2.75; 52 -5.5,2.25; 53 -5.5,1.75; 54 -5.5,1.25; 55 -5.5,0.75; 56 -5.5,0.25; 57 -5.5,-0.25; 58 -5.5,-0.75; 59 -5.5,-1.25; 60 -5.5,-1.75; 61 -5.5,-2.25; 62 -5.5,-2.75; 63 -5.5,-3.25; 64 -5.5,-3.75
SOT23-5 = smd 0.55 x 1.2: 1 -0.95,-1.3; 2 0,-1.3; 3 0.95,-1.3; 4 0.95,1.3; 5 -0.95,1.3
520426-4 = drill 0.889: 1 -4.445,6.35; 2 -3.175,8.89; 3 -1.905,6.35; 4 -0.635,8.89; 5 0.635,6.35; 6 1.905,8.89; 7 3.175,6.35; 8 4.445,8.89 | hole 3.251: -5.715,0; 5.715,0
1X06_NO_SILK = drill 1.016 pad 1.88: 1 0,0; 2 2.54,0; 3 5.08,0; 4 7.62,0; 5 10.16,0; 6 12.7,0
R0402 = smd 0.7 x 0.9: 1 -0.65,0; 2 0.65,0
22-23-2041 = drill 1 long: 1 -3.81,0; 2 -1.27,0; 3 1.27,0; 4 3.81,0

### Placement (x,y rotation side)
C1  67.24,30.6 90 top
C2  14.93,36.68 270 top
C3  3.87,75.81 90 top
C4  21.66,79.09 90 top
C5  41.65,79.04 90 top
C6  61.85,79.09 90 top
C7  51.44,11.51 270 top
C8  75.8,31.75 180 top
C9  5.25,49.63 0 top
C10  14.4,50.85 0 top
C11  25.21,50.83 180 top
C12  72.45,31.75 180 top
C13  2.1,45.7 270 top
C14  13.9,46.45 180 top
C15  6.72,70.22 0 top
C16  26.6,70.19 0 top
C17  13.38,70.16 180 top
C18  33.47,70.19 180 top
C19  32.39,38.08 180 bottom
C20  45.86,32.68 180 bottom
C21  60.46,2.21 180 top
C22  10.92,65.57 0 top
C23  30.92,65.57 0 top
C24  47.86,38.04 0 bottom
C25  8.49,59.87 180 top
C26  28.49,59.87 180 top
C27  60.48,14.21 180 top
C28  67.49,14.9 90 top
C29  48.34,18.7 0 top
C30  23.41,9.74 180 top
C31  48.35,36.59 180 top
C32  48.33,23.56 0 top
C33  48.35,34.84 180 top
C34  47.97,33.27 180 top
C35  47.97,31.72 180 top
C36  48.29,59.67 180 top
C37  68.29,59.67 180 top
C38  50.72,65.37 0 top
C39  70.72,65.37 0 top
C40  75.8,18 180 top
C41  72.45,18.01 180 top
C42  53.38,69.96 180 top
C43  73.47,69.99 180 top
C44  17.26,11.26 90 top
C45  46.52,70.02 0 top
C46  66.4,69.99 0 top
C47  65.8,46.05 0 top
C48  77.95,45.55 90 top
C49  6.42,33.99 270 top
C50  11.87,17.43 180 top
C51  65.01,50.63 180 top
C52  54.2,50.65 0 top
C53  15.7,21.86 180 top
C54  74.8,41.62 180 top
C55  11.87,26.77 180 top
C56  11.87,35.14 0 top
C57  54.7,36.45 270 top
C58  18.46,73.49 270 top
C59  58.4,73.5 270 top
C60  61.6,73.5 90 top
C61  21.5,73.5 90 top
IC1  70.75,28.8 270 top
IC2  19.8,39.89 0 top
IC3  7.2,45.75 270 top
IC4  19.8,50.83 180 top
IC5  10,72.35 180 top
IC6  30,72.35 180 top
IC7  10,62.74 270 top
IC8  30,62.74 270 top
IC9  MAX1680/1SO08  [SO08']  60.46,8.22 0 top
IC10  39.9,34.32 270 top
IC11  25.36,12.25 90 top
IC12  70.75,15 270 top
IC13  49.8,62.54 270 top
IC14  69.8,62.54 270 top
IC15  50,72.15 180 top
IC16  70,72.15 180 top
IC17  15.3,16.11 0 top
IC18  59.6,50.63 180 top
IC19  72.85,45.5 90 top
IC20  15.3,25.45 0 top
IC21  9.85,32.23 270 top
IC22  59.56,39.89 0 top
J1  40,4.46 0 top
JP1  33.58,47.3 0 top
L1  1.79,76.67 0 top
L2  21.02,81.44 0 top
L3  41.02,81.44 0 top
L4  61.19,81.44 0 top
L5  3.1,78.59 0 top
L6  23.46,80.77 270 top
L7  43.53,80.77 270 top
L8  63.69,80.77 270 top
L9  49.19,21.24 90 top
R1  25.47,36.59 90 top
R2  22.36,34.72 270 top
R3  21.24,17.69 0 top
R4  21.23,16.21 180 top
R5  41.91,18.32 90 top
R6  74.56,28.47 270 top
R7  78.28,28.47 90 top
R8  24.78,17.7 180 top
R9  24.77,16.21 0 top
R10  76.43,28.47 90 top
R11  13.61,43.37 0 top
R12  13.61,41.87 0 top
R13  26.15,43.35 180 top
R14  26.15,41.82 180 top
R15  9.97,75.81 180 bottom
R16  29.97,75.85 180 bottom
R17  31.6,38 90 top
R18  31.3,35 90 top
R19  5.25,61.24 90 top
R20  6.94,68.21 180 top
R21  25.25,61.24 90 top
R22  26.94,68.21 180 top
R23  29.7,38 90 top
R24  29.7,35 90 top
R25  3.33,61.26 270 top
R26  23.33,61.26 270 top
R27  28.2,38 90 top
R28  28.2,35 90 top
R29  6.94,65.55 0 top
R30  26.94,65.55 0 top
R31  15.44,61.32 180 top
R32  15.42,62.76 180 top
R33  35.44,61.32 180 top
R34  35.42,62.76 180 top
R35  14.82,58.96 270 top
R36  34.82,58.96 270 top
R37  14.3,64.72 180 top
R38  34.3,64.72 180 top
R39  28.68,11.65 90 top
R40  39.64,22.72 90 top
R41  21.34,13.19 180 top
R42  54.1,64.52 180 top
R43  74.1,64.52 180 top
R44  54.62,58.76 270 top
R45  76.12,58.76 270 top
R46  55.24,61.12 180 top
R47  55.22,62.56 180 top
R48  76.74,61.12 180 top
R49  75.22,62.56 180 top
R50  74.56,14.7 270 top
R51  78.28,14.7 90 top
R52  76.43,14.7 90 top
R53  46.74,65.35 0 top
R54  66.74,65.35 0 top
R55  43.13,61.06 270 top
R56  63.13,61.06 270 top
R57  45.05,61.04 90 top
R58  46.74,68.01 180 top
R59  65.05,61.04 90 top
R60  66.74,68.01 180 top
R61  49.97,75.61 180 bottom
R62  69.97,75.65 180 bottom
R63  14.67,12.25 0 top
R64  15.2,19.78 180 top
R65  8.46,29.49 270 top
R66  53.41,43.37 0 top
R67  53.41,41.67 0 top
R68  65.95,43.35 180 top
R69  65.95,41.62 180 top
U$1  [LOGO_5]  53.28,65.42 0 bottom
U$4  [LOGO_7]  39.5,73.4 0 top
X1  10,80.34 0 top
X2  30,80.34 0 top
X3  50,80.34 0 top
X4  70,80.34 0 top

### Tracks (layer width: path | path; a pad name or v marks a point on that pad's centre or on a via)
5V_G1
  Top 0.61: L5.2 4.43,78.58 X1.1
5V_G2
  Top 0.61: L6.2 25.97,80.12 X2.1
5V_G3
  Top 0.61: L7.2 45.97,80.12 X3.1
5V_G4
  Top 0.61: L8.2 65.97,80.12 X4.1
!CS_ADC  (via drill 0.25 pad 0.6)
  Top 0.203: IC10.13 33.34,32.07 33.15,31.88 v33.15,16.5 33.15,13.72 v33.52,13.35 | R8.1 R9.2 26.65,16.21 v26.66,16.22
  Bottom 0.203: J1.2 v33.52,13.35 | v26.66,16.22 32.87,16.22 v33.15,16.5
!CS_POT  (via drill 0.25 pad 0.6)
  Top 0.203: IC22.4 57.93,25.28 v57.67,25.02 | J1.1 35.55,24.48 v35.01,25.02 | v18.18,25.14 18.18,17.84 v18.33,17.69 | IC2.4 v18.18,25.14 | v18.18,25.14 | R3.1 | R4.2 R3.1 | v19.82,17.69 R3.1
  Bottom 0.203: v57.67,25.02 v35.01,25.02 18.29,25.02 v18.18,25.14 | v18.33,17.69 19.8,17.69 v19.82,17.69
+5V  (via drill 0.35 pad 0.65)
  Top 0.203: IC1.3 69.4,26.95 v69.4,26.75 | 69.25,29.9 IC1.1 v69.4,30.75
  Top 0.254: 8.44,33.24 8.46,33.21 | R65.2 8.46,28.68 v8.47,27.93 | v8.46,34.28 8.46,33.21 | 8.46,33.21 8.48,33.19
  Top 0.406: C1.1 | C29.2 L9.1
  Top 0.61: IC21.1 8.48,33.19 6.47,33.19 C49.2 6.43,33.18 | IC9.8 53.97,10.82 C7.+ 51.49,13.35 51.49,18.8 | C1.1 67.24,20.84 66.7,20.3 52,20.3 51.49,19.79 51.49,18.8 | C1.1 IC1.1 | C29.2 51.39,18.7 51.49,18.8
  Top 0.762: 51.42,13.37 C7.+ | 6.43,33.18 6.43,7.57 v7,7
  Top 1.676: J1.8 C7.+
  Bottom 0.203: v69.4,26.75 v69.4,30.75
  Bottom 0.254: v8.47,27.93 v8.47,34.28 v8.46,34.28
  Bottom 0.762: v7,7 43.9,7 44.44,7.54 J1.8
A1  (via drill 0.25 pad 0.6)
  Top 0.254: IC7.7 13.15,63.06 v13.45,63.36 13.45,64.81 R37.2 | v43.5,53.9 43.74,53.66 JP1.5 43.65,47.21 IC10.49
  Bottom 0.254: v13.45,63.36 18.14,63.36 18.4,63.1 18.4,54.1 18.6,53.9 v43.5,53.9
A2  (via drill 0.25 pad 0.6)
  Top 0.254: IC8.7 33.15,63.06 v33.45,63.36 33.45,64.81 R38.2 | v41,63.3 41.2,63.1 JP1.4 41.2,43.2 41.5,42.9 42.3,42.9 42.65,42.55 IC10.51
  Bottom 0.254: v33.45,63.36 40.94,63.36 v41,63.3
A3  (via drill 0.25 pad 0.6)
  Top 0.254: IC13.7 52.95,62.86 v53.25,63.16 53.25,64.61 R42.2 | v39,55.9 38.66,55.56 JP1.3 38.7,47.26 38.7,47.1 39.65,46.15 IC10.57
  Bottom 0.254: v53.25,63.16 58.14,63.16 58.4,62.9 58.4,56.2 58.1,55.9 v39,55.9
A4  (via drill 0.25 pad 0.6)
  Top 0.254: IC14.7 72.95,62.86 v73.25,63.16 73.25,64.61 R43.2 | v37.6,54.8 37.3,54.5 37.3,48.5 36.12,47.32 JP1.2 36.1,47.28 36.1,43.4 36.6,42.9 38.23,42.9 38.65,42.48 IC10.59
  Bottom 0.254: v73.25,63.16 77.94,63.16 78.2,62.9 78.2,55.1 77.9,54.8 v37.6,54.8
A5V  (via drill 0.25 pad 0.6, 0.35 pad 0.65)
  Top 0.254: IC10.48 47.12,38.07 v47.17,38.02 | IC10.1 32.96,38.07 v33.06,38.07 | IC10.38 46.51,33.07 v46.52,32.98 | IC10.37 46.32,32.57 v46.52,32.38
  Top 0.406: v50.5,23.1 50.5,23.5 | 50.5,23.5 v50.5,24 | 50.5,23.5 50.44,23.56 C32.2 L9.2
  Bottom 0.254: 47.31,38.09 C24.2 47.2,38.02 v47.18,38.02 | 32.94,38.07 C19.2 32.95,38.09 32.96,38.07 33.46,38.07 v33.06,38.07 | v47.17,38.02 v47.18,38.02 | v47.18,38.02 47.3,37.9 | C20.2 46.51,32.48 v46.52,32.38
  pour Route2: 51,21.5 27,21.5 27,39.1 51,39.1
AIN1+
  Top 0.254: IC5.P$4 8.49,74.5 8.2,74.8 8.2,79.81 X1.2
AIN1-
  Top 0.254: IC5.P$1 11.51,74.5 11.8,74.8 11.8,79.81 X1.3
AIN2+
  Top 0.254: IC6.P$4 28.5,74.5 28.2,74.8 28.2,79.81 X2.2
AIN2-
  Top 0.254: IC6.P$1 31.5,74.5 31.8,74.8 31.8,79.81 X2.3
AIN3+
  Top 0.254: IC15.P$4 48.49,74.31 48.2,74.6 48.2,79.81 X3.2
AIN3-
  Top 0.254: IC15.P$1 51.51,74.31 51.8,74.6 51.8,79.81 X3.3
AIN4+
  Top 0.254: IC16.P$4 68.5,74.31 68.2,74.6 68.2,79.81 X4.2
AIN4-
  Top 0.254: IC16.P$1 71.5,74.31 71.8,74.6 71.8,79.81 X4.3
CONVST  (via drill 0.25 pad 0.6)
  Top 0.203: IC10.9 IC10.10 30.73,33.57 30.55,33.39 30.55,9.92 v30.94,9.53
  Bottom 0.203: v30.94,9.53 37.8,9.53 38.13,9.86 38.13,10.78 J1.3
GND  (via drill 0.25 pad 0.6, 0.35 pad 0.65)
  Top 0.305: R9.1
  Top 0.406: 69.8,15.95 IC12.1 | R7.2 78.55,29.12
  Top 0.508: 7.5,32.22 9.75,32.22 | IC1.2 71.25,28.8 | 71.11,15.95 69.8,15.95 | 68.17,28.81 70.42,28.81
  Bottom 0.508: 70.4,28.8 71.25,28.8 | 71.11,15.95 69.8,15.95
  other vias: 17.81,44.22 21.67,44.22 19.74,44.22 62.47,17.69 60.47,17.69 58.47,17.69 61.84,77.12 3.87,73.88 56.47,17.69 56.47,15.69 56.47,13.69 56.47,9.69 56.47,7.69 56.47,5.69 56.47,3.69 56.47,1.69 51.4,7.59 48.86,9.67 53.98,9.69 54.63,15.7 34.35,29.7 35.27,28.74 44.52,28.7 45.43,29.74 44.93,40.22 6.38,35.98 13.84,35.15 14.92,34.82 11.2,28.01 17.4,23.29 13.49,13.7 11.15,18.67 18.57,10.43 17.36,14.78 22.72,10.87 26.7,10.22 23,16.21 30.65,38.02 50.36,36.6 50.33,34.85 49.81,33.23 49.8,31.82 55.93,35.75 34.88,40.21 11.2,30.26 12.7,30.26 12.7,31.76 9.7,30.26 62.49,35.7 17.47,35.63 28.77,29.89 23.52,29.89 42.52,23.14 31.77,23.14 56.02,30.39 28.27,18.39 8.98,65.57 28.98,65.57 16.08,46.46 7.12,49.6 2.09,43.9 10.22,59.85 14.82,57.15 2.22,60.59 22.27,60.59 30.22,59.85 34.82,57.15 6.08,71.27 25.95,71.21 14.01,71.2 34.11,71.22 12.42,50.85 25.84,51.92 9.61,69 29.61,69 57.61,44.02 61.47,44.02 59.54,44.02 48.78,65.37 68.78,65.37 63.62,46.04 72.93,41.65 77.95,47.35 50.02,59.65 54.62,56.95 42.02,60.39 62.07,60.39 69.92,59.65 76.12,56.95 45.88,71.07 65.75,71.01 54.01,71 74.11,71.02 52.22,50.65 65.64,51.72 49.61,68.8 69.61,68.8 41.62,77.05 21.65,77.11 67.47,16.99 69.37,16.99 67.21,32.6 56.47,11.79 78.29,30.2 78.29,16.5 7.47,77.88 8.87,77.88 11.07,77.88 12.47,77.88 12.47,75.08 7.47,75.08 28.87,77.88 27.47,77.88 31.07,77.88 32.47,77.88 32.47,74.88 27.47,74.88 47.47,77.88 48.87,77.88 51.07,77.88 52.47,77.88 52.47,74.48 47.47,74.48 67.47,77.88 68.87,77.88 71.07,77.88 72.47,77.88 72.47,74.48 67.47,74.48 32.75,34.25 28.94,33.46 40.67,29.89 44.37,31.59 44.37,34.79 44.37,34.09 44.37,37.59 35.52,37.6 54.63,17.69 20,75 20,72 20,69 20,66 60,75 60,72 60,69 60,66 60,63 60,60 20,63 20,60 60,57 20,57 7.47,73.58 7.47,72.28 12.47,73.58 12.47,72.28 37.78,44.41 41.18,41.61 42.48,44.51 75.45,48.65 4.52,42.6 49.66,38.1 44.27,32.39 44.27,33.09 71.49,19.5 71.49,20.6 72.69,20.6 73.49,20.6 74.29,20.6 75.09,20.6 75.09,34.3 74.29,34.3 73.49,34.3 72.69,34.3 71.49,34.3 71.49,33.2 75.89,20.6 76.69,20.6 77.49,20.6 77.49,21.4 76.69,21.4 75.89,21.4 75.09,21.4 75.89,34.3 76.69,34.3 77.49,34.3 77.49,35.1 76.69,35.1 75.89,35.1 75.09,35.1 74.29,35.1 73.49,35.1 72.69,35.1 71.49,35.1 27.47,73.58 27.47,72.28 32.47,73.58 32.47,72.28 47.47,73.28 47.47,71.98 52.47,73.28 52.47,71.98 67.47,73.28 67.47,71.98 72.47,73.28 72.47,71.98 46.29,23.56 46.31,18.69 54.63,13.69 30,55 33,55 30,52 33,52 45,54 48,54 42,57 37,57 40,57 40,53 42,53 52,54 54,54 58,54 61,54 63,57 52,57 40,69 40,65 40,61 64.47,5.69 64.47,7.69 64.47,9.69 64.47,11.69 64.47,3.69 66.47,3.69 66.47,5.69 66.47,7.69 66.47,9.69 66.47,11.69
  pour Top (rank 2): 0,86.5 0,39.6 71,39.6 71,0 80,0 80,86.5
  pour Bottom (rank 2): 0,86.5 0,39.6 71,39.6 71,0 80,0 80,86.5
  pour Bottom (rank 2): 0,39.1 70.5,39.1 70.5,0 0,0
  pour Top: 0,39.1 70.5,39.1 70.5,0 0,0
N$2
  Top 0.254: R65.1 8.46,31.24 IC21.3
N$3
  Top 0.203: 72.51,14.05 IC12.4 | R51.1
  Top 0.254: R51.1 R52.1 R50.2 72.51,14.05
N$4
  Top 0.254: IC17.2 15.3,12.26 R63.2 17.38,12.25 C44.2
N$5
  Top 0.254: IC10.36 45.99,32.07 46.37,31.7 47.27,31.7 C35.2 47.1,31.9
N$6
  Top 0.254: IC6.P$7 30.32,68.53 30,68.2 R22.1
N$7
  Top 0.203: 76.43,17.98 C40.1
  Top 0.254: R52.2 76.43,17.98
N$8
  Top 0.61: C6.2 61.86,81.52 L4.2 61.85,81.42 L8.1
N$9
  Top 0.254: IC17.4 16.25,19.37 R64.1
N$10
  Top 0.406: IC9.2 59.83,2.84 59.19,2.21 C21.+
N$11
  Top 0.406: IC9.4 62.37,2.64 C21.-
N$12
  Top 0.203: IC12.2 IC12.3
  Top 0.406: IC9.5 62.37,13.79 C27.- | 62.33,10.54 62.33,11.04 IC9.5 | 62.44,11 IC9.5
  Top 0.61: 62.37,13.79 62.62,14.05 C28.1 IC12.3
N$13
  Top 0.254: IC20.2 15.3,22.29 C53.2 14.55,21.53 R64.2
N$14
  Top 0.254: IC7.6 13.42,62.41 13.77,62.76 R32.2 14.77,64.8 R37.1
N$15
  Top 0.254: IC10.39 47.12,33.57 C34.2
N$16
  Top 0.254: IC13.2 47.49,62.87 46.4,62.87 46.1,63.17 R53.1 46.09,65.15 R58.2
N$17
  Top 0.254: IC7.2 7.69,63.07 6.6,63.07 6.3,63.37 R29.1 6.29,65.35 R20.2
N$18
  Top 0.254: IC7.3 7.68,62.41 6.65,62.41 6.2,61.95 5.31,61.95 R19.2 5.24,61.91 R25.1
N$19
  Top 0.254: IC7.5 13.16,61.76 13.61,61.31 R31.2 14.79,59.63 R35.1 14.79,59.49
N$20
  Top 0.254: IC10.42 47.29,35.07 C33.2
N$21
  Top 0.254: IC13.3 47.48,62.21 46.45,62.21 46,61.75 45.11,61.75 R57.2 45.03,61.71 R55.1
N$22
  Top 0.254: IC13.6 53.22,62.21 53.56,62.56 R47.2 54.57,64.6 R42.1
N$23
  Top 0.254: IC13.5 52.96,61.56 53.41,61.12 R46.2 54.59,59.43 R44.1 54.59,59.29
N$24
  Top 0.254: 47.28,36.57 C31.2 47.48,36.57 IC10.45 IC10.44
N$25
  Top 0.203: 76.7,29.15 R10.2 76.45,29.14
  Top 0.254: C8.1 76.45,29.14
N$26
  Top 0.203: 74.53,27.85 R6.2
  Top 0.254: R6.2 R10.1 R7.1 | IC1.4 74.53,27.85
N$27  (via drill 0.25 pad 0.6)
  Top 0.254: IC5.P$2 10.32,75.22 v10.62,75.51
  Bottom 0.254: v10.62,75.51 R15.2
N$28  (via drill 0.25 pad 0.6)
  Top 0.254: IC5.P$3 9.68,75.16 v9.32,75.51
  Bottom 0.254: v9.32,75.51 R15.1
N$29
  Top 0.254: R20.1 10.03,68.21 10.32,68.5 IC5.P$7
N$30
  Top 0.254: IC8.2 27.69,63.07 26.6,63.07 26.3,63.37 R30.1 26.29,65.35 R22.2
N$31  (via drill 0.25 pad 0.6)
  Top 0.254: IC6.P$2 30.32,75.25 v30.62,75.55
  Bottom 0.254: v30.62,75.55 R16.2
N$32  (via drill 0.25 pad 0.6)
  Top 0.254: IC6.P$3 29.68,75.2 v29.32,75.55
  Bottom 0.254: v29.32,75.55 R16.1
N$33
  Top 0.254: IC8.3 27.68,62.41 26.65,62.41 26.2,61.95 25.31,61.95 R21.2 25.23,61.91 R26.1
N$34
  Top 0.254: IC7.1 7.59,64.01 R29.2 7.55,65.39 7.55,66.63 8.02,67.1 15.6,67.1 16.07,66.63 R32.1
N$35
  Top 0.254: IC8.6 33.42,62.41 33.77,62.76 R34.2 34.77,64.8 R38.1
N$36
  Top 0.305: C9.1 4.6,47.67 IC3.1
N$37
  Top 0.254: IC8.5 33.16,61.76 33.61,61.31 R33.2 34.79,59.63 R36.1 34.79,59.49
N$38  (via drill 0.25 pad 0.6)
  Top 0.254: IC15.P$2 50.33,75.02 v50.62,75.31
  Bottom 0.254: v50.62,75.31 R61.2
N$39
  Top 0.254: IC8.1 27.59,64.01 R30.2 27.55,65.39 27.55,66.63 28.02,67.1 35.6,67.1 36.07,66.63 R34.1
N$40  (via drill 0.25 pad 0.6)
  Top 0.254: IC15.P$3 49.67,74.96 v49.32,75.31
  Bottom 0.254: v49.32,75.31 R61.1
N$41
  Top 0.254: R58.1 50.03,68.01 50.32,68.3 IC15.P$7
N$42
  Top 0.254: IC4.10 16.94,51.46 18.2,51.46 19.42,50.24 19.42,46.47 18.83,45.88 IC2.20 18.83,42.09 18.63,41.9 14.38,41.9 R12.2
N$43  (via drill 0.25 pad 0.6)
  Top 0.254: IC16.P$2 70.33,75.05 v70.62,75.35
  Bottom 0.254: v70.62,75.35 R62.2
N$44
  Top 0.254: IC4.5 22.67,51.49 21.49,51.49 20.15,50.15 20.15,46.46 20.79,45.82 20.79,42.82 IC2.17 20.78,42.09 21,41.87 25.4,41.87 R14.2
N$45  (via drill 0.25 pad 0.6)
  Top 0.254: IC16.P$3 69.67,75 v69.32,75.35
  Bottom 0.254: v69.32,75.35 R62.1
N$46
  Top 0.254: R11.1 R12.1 12.96,40.84 13.2,40.6 26.5,40.6 26.8,40.9 R14.1 R13.1
  Top 0.305: 26.9,43.37 R13.1 | IC3.7 12.79,46.38 C14.2 | 12.8,46.4 C14.2 | R11.1 12.96,45.6 | 12.96,45.6 12.96,46.34 C14.2 | IC3.6 12.47,45.12 12.96,45.6
N$47
  Top 0.254: IC18.10 56.74,51.26 58,51.26 59.22,50.04 59.22,46.27 58.58,45.63 IC22.20 58.58,41.95 58.33,41.7 54.18,41.7 R67.2
N$48
  Top 0.254: 56.58,49.97 56.74,49.97 | 56.74,49.97 IC18.12 | R66.2 55.34,43.37 56.58,44.62 | 56.74,49.97 57.65,49.97 58.64,48.98 58.64,46.67 56.58,44.62 | IC22.23 56.63,44.57 56.58,44.62
N$49
  Top 0.305: IC11.2 28.61,12.25 R39.2
N$50
  Top 0.203: IC2.10 22.08,35.42
  Top 0.254: 22.08,35.42 R2.1
N$51
  Top 0.61: C5.2 41.67,79.92 41.67,81.42 L3.2 41.68,81.42 L7.1
N$52
  Top 0.254: IC18.3 62.44,49.94 61.46,49.94 60.52,49 60.52,46.62 62.47,44.67 62.48,44.66 | R68.2 63.79,43.35 62.48,44.66 | IC22.14 62.48,44.66
N$53
  Top 0.254: IC18.5 62.47,51.29 61.29,51.29 59.95,49.95 59.95,46.26 60.53,45.68 IC22.17 60.53,41.94 60.8,41.67 65.2,41.67 R69.2
N$54
  Top 0.254: IC13.1 47.39,63.81 R53.2 47.35,65.19 47.35,66.43 47.82,66.9 55.4,66.9 55.87,66.43 R47.1
N$55
  Top 0.305: C54.1 75.45,43.58 IC19.1
N$56
  Top 0.254: R66.1 R67.1 52.76,40.65 53,40.4 66.3,40.4 66.6,40.7 R69.1 R68.1 | 66.8,45.9 C47.2 66.6,46 | 70.21,46.12 IC19.6
  Top 0.305: C47.2 66.92,46.12 70.21,46.12 | 66.9,46.1 C47.2 | 66.75,46.16 C47.2 | R68.1 66.6,45.2 | 66.6,45.2 66.6,46 | IC19.7 66.94,44.87 66.6,45.2
N$57
  Top 0.254: IC2.14 22.73,44.61 | IC4.3 22.64,50.14 21.66,50.14 20.72,49.2 20.72,46.62 22.73,44.61 | R13.2 23.99,43.35 22.73,44.61
N$58
  Top 0.254: IC14.2 67.49,62.87 66.4,62.87 66.1,63.17 R54.1 66.09,65.15 R60.2
N$59
  Top 0.254: IC14.3 67.48,62.21 66.45,62.21 66,61.75 65.11,61.75 R59.2 65.03,61.71 R56.1
N$60
  Top 0.254: IC14.6 73.22,62.21 73.56,62.56 R49.2 74.57,64.6 R43.1
N$61
  Top 0.254: IC14.5 72.96,61.56 73.41,61.12 R48.2 76.09,59.43 R45.1 76.09,59.29
N$62
  Top 0.254: IC2.23 16.88,44.71 | 16.78,50.17 16.94,50.17 | 16.94,50.17 IC4.12 | R11.2 15.54,43.37 16.88,44.71 | 16.94,50.17 17.85,50.17 18.84,49.18 18.84,46.67 16.88,44.71
N$63
  Top 0.203: IC11.4 21.82,13.2
  Top 0.305: 21.82,13.2 R41.1
N$64
  Top 0.254: IC14.1 67.39,63.81 R54.2 67.35,65.19 67.35,66.43 67.82,66.9 75.4,66.9 75.87,66.43 R49.1
N$65
  Top 0.254: IC16.P$7 70.33,68.33 70,68 R60.1
N$72
  Top 0.61: 23.44,81.44 L6.1 23.45,81.44 L2.2 C4.2
N$73
  Top 0.61: C3.2 L1.2 L5.1
N$78
  Top 0.203: IC10.24 39.65,23.39 R40.2
OFF0
  Top 0.254: IC4.14 IC4.13 10.97,49.53 10.6,49.9 10.6,57 10.2,57.4 5.56,57.4 5.25,57.71 R19.1
OFF1
  Top 0.254: IC4.9 IC4.8 16.91,52.8 16.4,52.8 16.09,53.11 R31.1
OFF2
  Top 0.254: IC4.1 IC4.2 | 22.72,49.49 IC4.2 | IC4.2 26.79,49.53 27.1,49.84 27.1,58.1 25.25,59.95 R21.1
OFF3  (via drill 0.25 pad 0.6)
  Top 0.254: IC4.7 IC4.6 | IC4.7 22.68,52.22 22.75,52.15 | R33.1 36.1,61.31 36.1,53.14 36.03,53.07 v35.74,52.78 | IC4.7 23.58,52.78 v23.6,52.8
  Bottom 0.254: v23.6,52.8 35.72,52.8 v35.74,52.78
OFF4
  Top 0.254: IC18.14 IC18.13 50.77,49.33 50.4,49.7 50.4,56.8 50,57.2 45.36,57.2 45.05,57.51 R57.1
OFF5
  Top 0.254: IC18.9 IC18.8 56.71,52.6 56.2,52.6 55.89,52.91 R46.1
OFF6
  Top 0.254: IC18.1 IC18.2 | 62.52,49.29 IC18.2 | R59.1 65.05,59.75 66.9,57.9 66.9,49.64 66.59,49.33 IC18.2
OFF7  (via drill 0.25 pad 0.6)
  Top 0.254: IC18.7 IC18.6 | IC18.7 62.48,52.02 62.55,51.95 | R48.1 77.4,61.11 77.4,52.94 v77.04,52.58 | IC18.7 63.38,52.58 v63.4,52.6
  Bottom 0.254: v63.4,52.6 77.02,52.6 v77.04,52.58
OS0
  Top 0.203: IC10.3 33.47,37.08 33.2,37.35 R17.1 31.6,35.95 R18.2
OS1  (via drill 0.25 pad 0.6)
  Top 0.203: R24.2 v29.7,36.56 R23.1 | IC10.4 33.11,36.57 v32.92,36.77
  Bottom 0.203: v32.92,36.77 32.85,36.7 29.85,36.7 v29.7,36.56
OS2  (via drill 0.25 pad 0.6)
  Top 0.203: IC10.5 33.07,36.07 v33,36 | R28.2 v28.2,36.4 R27.1
  Bottom 0.203: v33,36 28.6,36 v28.2,36.4
RESET  (via drill 0.25 pad 0.6)
  Top 0.203: 31.37,32.82 v31.43,32.82 31.68,33.07 IC10.11 | IC20.4 16.25,32.61 v16.46,32.82
  Bottom 0.203: v31.43,32.82 v16.47,32.82 v16.46,32.82
SCLK  (via drill 0.25 pad 0.6)
  Top 0.203: IC2.9 v21.43,31.14 | IC22.9 61.18,26.1 61.65,25.63 v61.71,25.63 | v21.68,25.63 21.43,25.88 v21.43,31.14 | v21.43,31.14 v21.43,31.15 | v19.27,25.87 19.27,13.52 19.59,13.2 R41.2 | IC10.12 32.7,32.57 v32.2,32.07
  Bottom 0.203: 22.47,25.63 v61.71,25.63 | v61.71,25.63 | 22.47,25.63 v21.68,25.63 19.51,25.63 v19.27,25.87 | 22.47,25.63 | 31,31.87 21.58,31.87 21.43,31.72 v21.43,31.15 | 31,31.87 | 31,31.87 32,31.87 v32.2,32.07
SCLK_UC  (via drill 0.25 pad 0.6)
  Top 0.203: R39.1 28.68,9.07 v29,8.75 | v39.37,9.02 J1.4
  Bottom 0.203: v29,8.75 39.1,8.75 v39.37,9.02
SDI
  Top 0.203: J1.6 R5.1
SDI_POT  (via drill 0.25 pad 0.6)
  Top 0.203: IC2.8 20.78,20.72 v21,20.5 | R5.2 41.91,20.29 v41.7,20.5
  Bottom 0.203: v21,20.5 40.5,20.5 | 40.5,20.5 40.79,20.5 | v41.7,20.5 40.5,20.5 | 40.5,20.5
SDI_POT34  (via drill 0.25 pad 0.6)
  Top 0.203: R2.2 25.34,34.07 25.52,34.25 | IC22.8 60.54,26.94 60.54,26.65 v60.09,26.2 | v25.52,26.55 25.52,34.25 | 25.52,34.25 25.52,35.89
  Top 0.254: 25.51,35.94 R1.1 25.52,35.89
  Bottom 0.203: v60.09,26.2 25.87,26.2 v25.52,26.55
SDO
  Top 0.203: J1.5 40.63,21.75 40.31,22.07 R40.1
V+  (via drill 0.35 pad 0.65)
  Top 0.203: C12.1 72.85,31.8 75.35,31.8 C8.2
  Top 0.254: 12.74,70.19 C17.2 | 11.6,65.6 C22.2 | 12.73,71.16 v12.72,71.21 | 31.59,65.6 C23.2 | 52.74,70 C42.2 | 51.4,65.4 C38.2 | 52.73,70.96 v52.72,71.01 | 71.39,65.4 C39.2
  Top 0.305: IC5.P$8 12.74,70.19 | IC7.8 12.11,65.03 C22.2 | v12.56,65.6 11.6,65.6 | C17.2 12.73,71.16 | IC8.8 32.11,65.03 C23.2 | v32.56,65.6 31.59,65.6 | v2.09,47.41 C13.1 2.13,46.38 IC3.2 | IC4.4 24.86,50.83 C11.2 | v24.57,51.9 C11.2 | C11.2 | IC6.P$8 33.02,70.19 C18.2 v32.82,71.2 v32.82,71.21 | IC15.P$8 52.74,70 | IC13.8 51.91,64.83 C38.2 | v52.37,65.4 51.4,65.4 | C42.2 52.73,70.96 | IC14.8 71.91,64.83 C39.2 | v72.36,65.4 71.39,65.4 | v77.95,43.84 C48.1 77.91,44.87 IC19.2 | IC18.4 64.66,50.63 C51.2 | v64.36,51.7 C51.2 | C51.2 | IC16.P$8 73.02,70 C43.2 v72.82,71 v72.82,71.01 | C58.1 18.46,75.52 v18.43,75.54 | v58.4,75.49 C59.1
  Top 0.61: C12.1 72.9,30.54 IC1.5 | L4.1 v60.54,82.5 v60.53,82.5 | L3.1 v40.37,82.51 | v40.37,82.51 40.36,82.52 | v40.37,82.51 v40.36,82.51 v40.36,82.5 | L2.1 20.37,82.39 v20.36,82.5 | L1.1 1.15,75.52 v1.16,75.5
  other vias: 72.7,33.2 73.5,33.2 74.3,33.2 75.1,33.2 74.3,32.4 74.3,31.6 72.7,30.8 73.5,30.8 74.3,30.8 75.1,30.8 75.1,30 74.3,30 73.5,30
  pour Route2: 0,86.5 80,86.5 80,21.5 51.5,21.5 51.5,39.6 0,39.6
  pour Top (no thermals): 72.3,29.4 75.5,29.4 75.5,33.6 72.3,33.6
V-  (via drill 0.35 pad 0.65)
  Top 0.203: C41.1 C40.2
  Top 0.254: 7.3,70.19 C15.2 7.4,70.19 | IC5.P$5 | 7.89,59.78 C25.2 7.89,59.74 | 27.89,59.78 C26.2 27.89,59.74 | 47.1,70 C45.2 47.2,69.99 | IC15.P$5 | 47.69,59.58 C36.2 47.69,59.54 | 67.69,59.58 C37.2 67.69,59.54
  Top 0.305: v7.4,71.2 7.4,70.19 IC5.P$5 | IC7.4 7.89,59.78 | IC8.4 27.89,59.78 | v27.89,58.76 27.89,59.82 C26.2 | 7.89,59.74 7.89,58.78 v7.89,58.75 | IC4.11 15.07,50.83 C10.2 v15.04,51.95 | IC6.P$5 C16.2 27.25,71.18 v27.25,71.21 | v47.2,71 47.2,69.99 IC15.P$5 | IC13.4 47.69,59.58 | IC14.4 67.69,59.58 | v67.69,58.56 67.69,59.62 C37.2 | 47.69,59.54 47.69,58.58 v47.69,58.55 | IC18.11 54.87,50.63 C52.2 v54.84,51.74 | IC16.P$5 C46.2 67.05,70.98 v67.05,71.01 | C61.1 v21.5,71.38 v21.5,71.37 | C60.1 v61.6,71.47
  Top 0.61: C41.1 73.3,16.74 72.5,15.95 IC12.5
  other vias: 72.7,19.5 74.3,19.5 73.5,19.5 75.1,19.5 74.3,18.7 74.3,17.9 75.1,17.1 75.1,16.3 74.3,16.3 74.3,17.1 73.5,17.1 72.7,17.1 73.5,16.3
  pour Route3: 0,86.5 80,86.5 80,0 51.5,0 51.5,39.6 0,39.6
  pour Top (no thermals): 72.3,15.7 75.5,15.7 75.5,19.9 72.3,19.9
VCCIO  (via drill 0.35 pad 0.65)
  Top 0.203: 12.5,26.75 C55.1 | 26.73,38.33 27.06,38.65 R27.2 R23.2 R17.2
  Top 0.254: v59.23,38.32 59.23,38.31 | IC22.6 | IC2.6 19.48,38.26 v19.42,38.33 | C2.1 v14.93,38.32 15.1,38.33 | R1.2 25.48,38.11 v25.26,38.33 | IC22.6 59.23,38.31 | 59.23,38.31 | IC22.6 59.23,38.31 | 59.23,38.31 59.21,38.33 | C57.1 54.7,38.27 v54.76,38.33 | 12.93,38.16 12.77,38.32 | IC22.6 IC22.5 | IC22.6 IC22.7 | IC2.6 IC2.7 | IC2.6 IC2.5 | IC10.7 IC10.6 33.51,35.57 v33.1,35.17 | 12.53,26.75 C55.1 | C50.1 14.33,17.43 IC17.5 | IC10.23 39.15,27.23 v39,27.07 | IC10.34 46.52,31.07 46.79,30.81 46.79,27.36 v46.5,27.07
  Top 0.305: R63.1 12.75,12.25 12.5,12.5 | C50.1 12.52,16.52 12.5,16.5 | v25.13,9.74 C30.1 IC11.5 | 22.92,17.7 R8.2 24.13,17.79 | 22.92,17.7 21.9,17.7 R3.2 | v23,18.69 23,17.79 22.92,17.7
  Top 0.61: v13.74,38.32 12.77,38.32 11.63,38.32 11.22,37.9 11.22,35.34 C56.1 11.21,34.89 IC21.5 13.82,33.18 14.35,32.65 IC20.5 12.53,26.75 | v53.5,27.5 53.5,38 53.77,38.27 54.7,38.27 | v27,27.5 v27,35.1 27,38.06 26.73,38.33 v25.27,38.33 v25.26,38.33 | 12.5,26.75 v12.5,18.5 12.5,16.5 12.5,12.5 v12.5,10
  Bottom 0.254: v14.93,38.32 14.69,38.16 14.52,38.33 | 54.74,38.35 59.2,38.35 v59.23,38.32 | v54.76,38.33 v59.22,38.33 | v33.1,35.17 27.13,35.17 v27,35.1
  Bottom 0.305: v25.13,9.74 12.76,9.74 v12.5,10 | v23,18.69 12.69,18.69 v12.5,18.5
  Bottom 0.61: v13.74,38.32 14.52,38.33 v19.42,38.33 v25.26,38.33 v25.27,38.33 | v54.76,38.33 v61.93,38.33 | v59.22,38.33 v59.23,38.32 | v53.5,27.5 53.07,27.07 v46.5,27.07 v39,27.07 27.43,27.07 v27,27.5

### Text on the board
tPlace: 5V I1+ I1- 0V | 5V I2+ I2- 0V | 5V I3+ I3- 0V | 5V I4+ I4- 0V | GND A4 A3 | A2 A1 V+ | load cells / v1.1 | Licensed under the TAPR Open / Hardware License (www.tapr.org/OHL) | Hardware / Platform | www.cf-hw.org | Licensed under the TAPR Open / Hardware License (www.tapr.org/OHL) / / Copyright 2018 Artur Silva and Filipe Carvalho